# Altium project PCB_Project.PrjPcb (part 1 of 4)
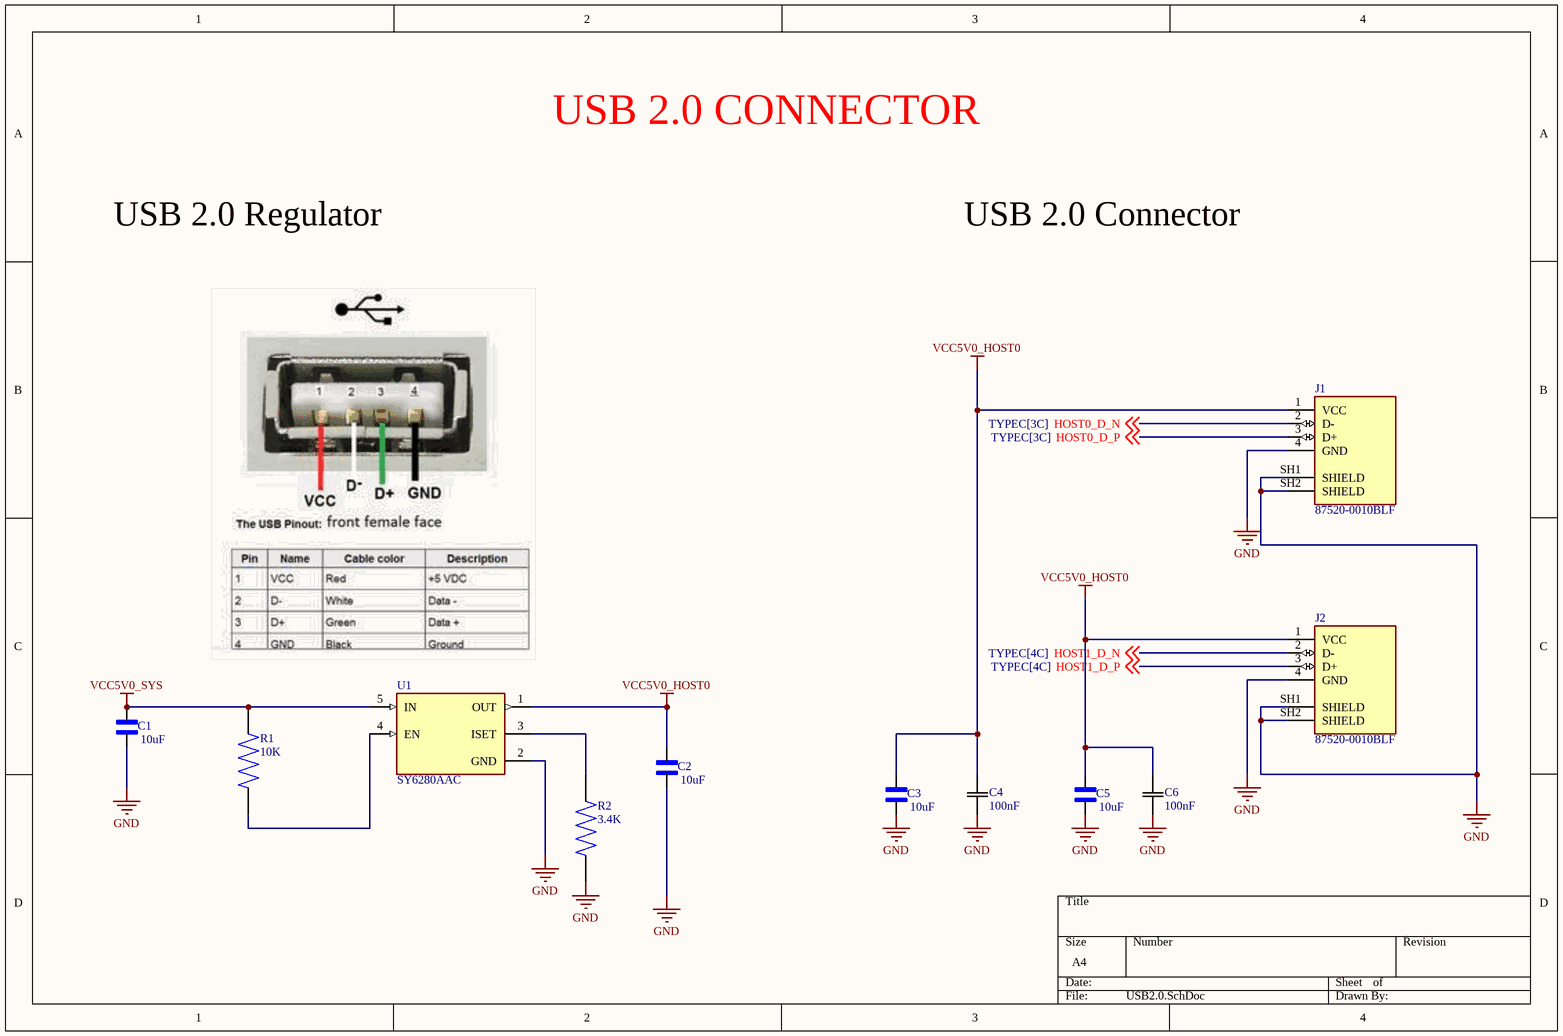
[diagram p0: USB2.0.SchDoc]
26 sheets, 501 parts. Net scope: global (net labels, ports and power ports of the same name join across sheets).
Board file: PCB1.~(76).PcbDoc
Sheets:
  USB2.0.SchDoc
  TYPEC0.SchDoc
  TYPEC.SchDoc
  System PMU for RK3399.SchDoc
  RGMII_SDIO_I2S.SchDoc
  SDMMC EMMC PCIE ADC Blocks.SchDoc
  RK3399 Side of LPDDR4 Controller.SchDoc
  Power Supply Page for RK3399.SchDoc
  HDMI_MIPI-DSI_EDP.SchDoc
  HDMI Connector for RK3399.SchDoc
  PMIC_Block_.SchDoc
  LPDDR4 SDRAM_1.SchDoc
  LPDDR4 SDRAM_2.SchDoc
  EMMC with rk399.SchDoc
  WIFI_MODULE.SchDoc
  SD Card and Debug Uart.SchDoc
  RGMII ETH PHY.SchDoc
  RJ45 Connector and ESD Diodes.SchDoc
  Regulators and Buck Converters.SchDoc
  Power Supply for CPU Blocks.SchDoc
  MIPI CSI 0 and 1 Connectors.SchDoc
  EDP and MIPI DSI Connectors.SchDoc
  CODEC and Headphone Jack.SchDoc
  40 Pin BS, FAN Connector and Test LEDs.SchDoc
  PCIE Connector.SchDoc
  I2C_GPIOs_MIPI-CSI.SchDoc

## Sheet USB2.0.SchDoc
size A4; SheetNumber: 1; SheetTotal: 26

### Parts
C1  10uF  [CAPC1005X70N]
C2  10uF  [CAPC1005X70N]
C3  10uF  [CAPC1005X70N]
C4  100nF  [CAP_1005_TDK]
C5  10uF  [CAPC1005X70N]
C6  100nF  [CAP_1005_TDK]
J1  87520-0010BLF  [AMPHENOL_87520-0010BLF]
J2  87520-0010BLF  [AMPHENOL_87520-0010BLF]
R1  10K  [RES_ERA3ARB103V]
R2  3.4K  [RES_ERJPA2F3401X]
U1  SY6280AAC  [SOT95P285X130-5N]

### Nets
GND: C1.1 C2.1 C3.1 C4.2 C5.1 C6.2 J1.4(GND) J1.SH1(SHIELD) J1.SH2(SHIELD) J2.4(GND) J2.SH1(SHIELD) J2.SH2(SHIELD) R2.1 U1.2(GND)
VCC5V0_HOST0: C2.2 C3.2 C4.1 C5.2 C6.1 J1.1(VCC) J2.1(VCC) U1.1(OUT)
VCC5V0_SYS: C1.2 R1.2 U1.5(IN)
HOST0_D_N: J1.2(D-) ; off-sheet HOST0_D_N
HOST0_D_P: J1.3(D+) ; off-sheet HOST0_D_P
HOST1_D_N: J2.2(D-) ; off-sheet HOST1_D_N
HOST1_D_P: J2.3(D+) ; off-sheet HOST1_D_P
NetR1_1: R1.1 U1.4(EN)
NetR2_2: R2.2 U1.3(ISET)

### Notes on the sheet
- USB 2.0 CONNECTOR
- USB 2.0 Regulator
- USB 2.0 Connector

### Library data of the parts
C1-C3 C5 = CL05A106MQ5NUNC: 10 ÂµF Â±20% 6.3V Ceramic Capacitor X5R 0402 (1005 Metric); MF: Samsung; SnapEDA_Link: https://www.snapeda.com/parts/CL05A106MQ5NUNC/Samsung/view-part/?ref=snap; Package: SMD-2 Samsung; Value: *; MP: CL05A106MQ5NUNC; Check_prices: https://www.snapeda.com/parts/CL05A106MQ5NUNC/Samsung/view-part/?ref=eda
C4 C6 = C1005X7R1H104M050BB: Description; Manufacturer_Name: TDK; Copyright: Copyright (C) 2025 Ultra Librarian. All rights reserved.; Manufacturer_Part_Number: C1005X7R1H104M050BB
J1 J2 = 87520-0010BLF: Conn Data USB TypeA Socket 4Cnts RightAngle ThruHole White 1.57mmPCB | Amphenol FCI (Amphenol CS) 87520-0010BLF; MF: AMPHENOL ICC / FCI; SnapEDA_Link: https://www.snapeda.com/parts/87520-0010BLF/Amphenol/view-part/?ref=snap; Package: None; Value: *; MP: 87520-0010BLF; Check_prices: https://www.snapeda.com/parts/87520-0010BLF/Amphenol/view-part/?ref=eda
R1 = ERA3ARB103V: MP: ERA3ARB103V; Availability: Unavailable; Package: None; Value: *; Price: None
R2 = ERJPA2F3401X: Package: None; Price: None; Value: *; MP: ERJPA2F3401X; Availability: Unavailable
U1 = SY6280AAC: USB Power Distribution SW Single 5.5V 1A 5-Pin SOT-23; MF: Silergy; SnapEDA_Link: https://www.snapeda.com/parts/SY6280AAC/Silergy/view-part/?ref=snap; Package: SOT-23-5 Silergy; Value: *; MP: SY6280AAC; Check_prices: https://www.snapeda.com/parts/SY6280AAC/Silergy/view-part/?ref=eda

## Sheet TYPEC0.SchDoc
size A4; SheetNumber: 2; SheetTotal: 26
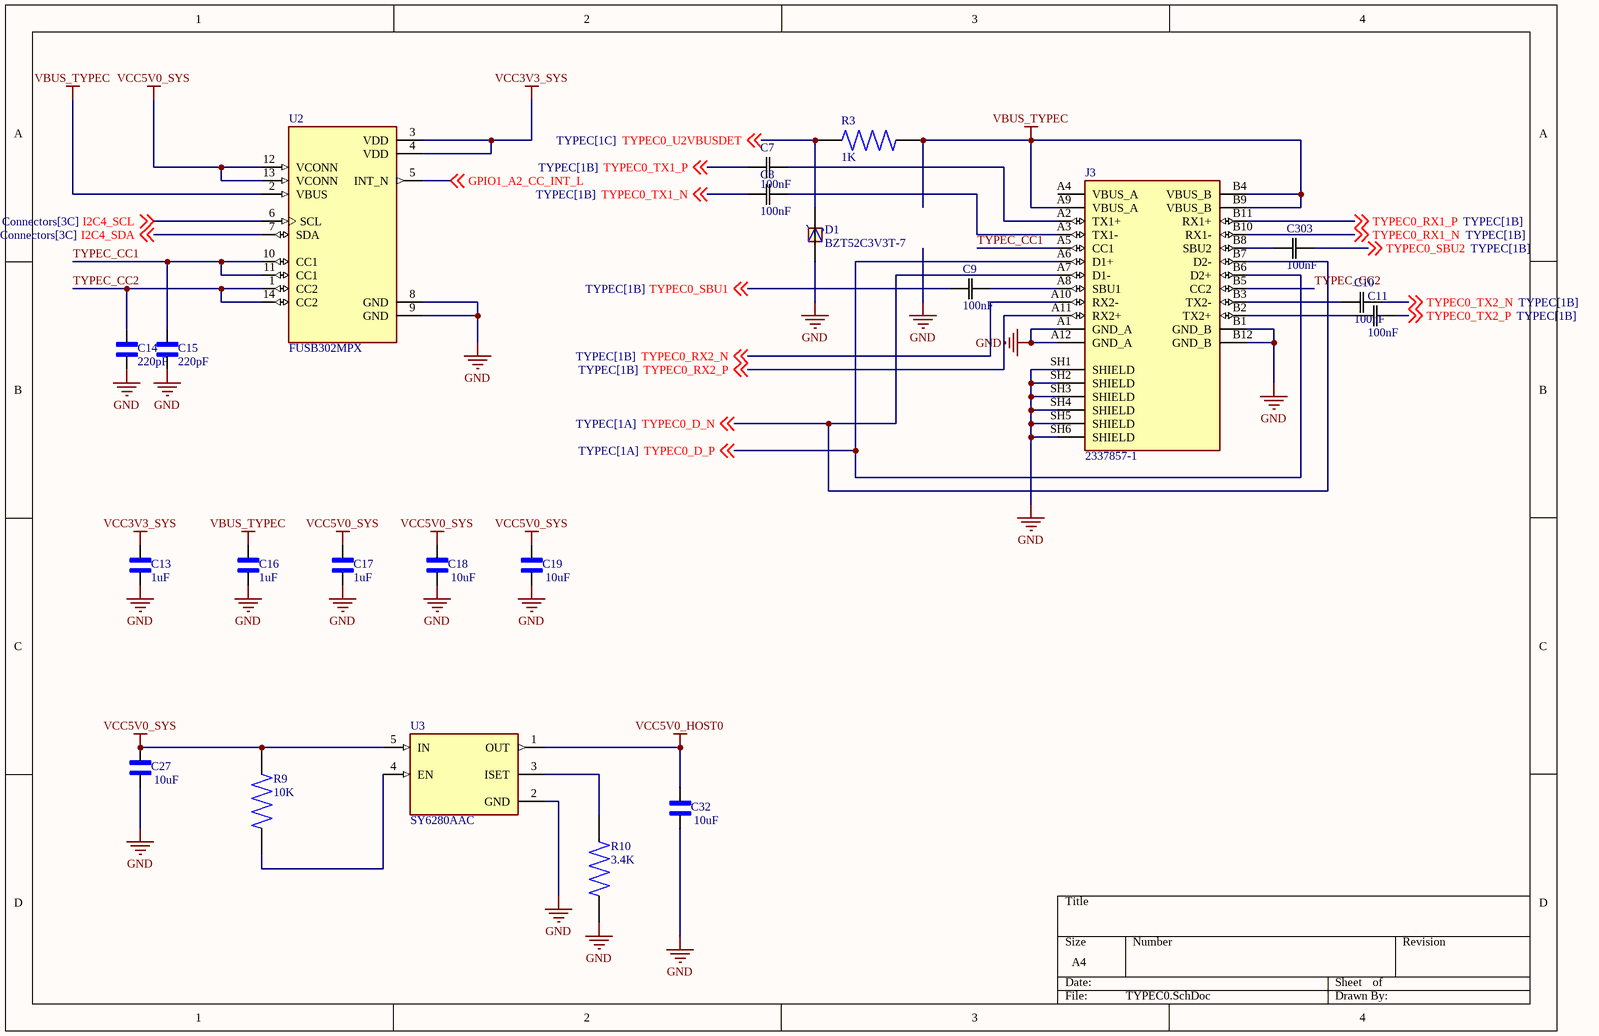
[diagram p1: TYPEC0.SchDoc]

### Parts
C7  100nF  [CAP_1005_TDK]
C8  100nF  [CAP_1005_TDK]
C9  100nF  [CAP_1005_TDK]
C10  100nF  [CAP_1005_TDK]
C11  100nF  [CAP_1005_TDK]
C13  1uF  [CAPC1005X56N]
C14  220pF  [CAPC1608X90]
C15  220pF  [CAPC1608X90]
C16  1uF  [CAPC1005X56N]
C17  1uF  [CAPC1005X56N]
C18  10uF  [CAPC1005X70N]
C19  10uF  [CAPC1005X70N]
C27  10uF  [CAPC1005X70N]
C32  10uF  [CAPC1005X70N]
C303  100nF  [CAP_1005_TDK]
D1  BZT52C3V3T-7  [SODFL1608X65N]
J3  2337857-1  [TE_2337857-1]
R3  1K  [RESC1608X55N]
R9  10K  [RES_ERA3ARB103V]
R10  3.4K  [RES_ERJPA2F3401X]
U2  FUSB302MPX  [QFN50P250X250X80-15N]
U3  SY6280AAC  [SOT95P285X130-5N]

### Nets
GND: C13.1 C14.2 C15.2 C16.1 C17.1 C18.1 C19.1 C27.1 C32.1 D1.A J3.A1(GND_A) J3.A12(GND_A) J3.B1(GND_B) J3.B12(GND_B) J3.SH1(SHIELD) J3.SH2(SHIELD) J3.SH3(SHIELD) J3.SH4(SHIELD) J3.SH5(SHIELD) J3.SH6(SHIELD) R10.1 U2.8(GND) U2.9(GND) U3.2(GND)
VBUS_TYPEC: C16.2 J3.A9(VBUS_A) J3.B4(VBUS_B) J3.B9(VBUS_B) R3.2 U2.2(VBUS)
VCC3V3_SYS: C13.2 U2.3(VDD) U2.4(VDD)
VCC5V0_HOST0: C32.2 U3.1(OUT)
VCC5V0_SYS: C17.2 C18.2 C19.2 C27.2 R9.2 U2.12(VCONN) U2.13(VCONN) U3.5(IN)
GPIO1_A2_CC_INT_L: U2.5(INT_N) ; off-sheet GPIO1_A2_CC_INT_L
I2C4_SCL: U2.6(SCL) ; off-sheet I2C4_SCL
I2C4_SDA: U2.7(SDA) ; off-sheet I2C4_SDA
TYPEC0_D_N: J3.A7(D1-) J3.B7(D2-) ; off-sheet TYPEC0_D_N
TYPEC0_D_P: J3.A6(D1+) J3.B6(D2+) ; off-sheet TYPEC0_D_P
TYPEC0_RX1_N: J3.B10(RX1-) ; off-sheet TYPEC0_RX1_N
TYPEC0_RX1_P: J3.B11(RX1+) ; off-sheet TYPEC0_RX1_P
TYPEC0_RX2_N: J3.A10(RX2-) ; off-sheet TYPEC0_RX2_N
TYPEC0_RX2_P: J3.A11(RX2+) ; off-sheet TYPEC0_RX2_P
TYPEC0_SBU1: C9.2 ; off-sheet TYPEC0_SBU1
TYPEC0_SBU2: C303.1 ; off-sheet TYPEC0_SBU2
TYPEC0_TX1_N: C8.2 ; off-sheet TYPEC0_TX1_N
TYPEC0_TX1_P: C7.2 ; off-sheet TYPEC0_TX1_P
TYPEC0_TX2_N: C10.1 ; off-sheet TYPEC0_TX2_N
TYPEC0_TX2_P: C11.1 ; off-sheet TYPEC0_TX2_P
TYPEC0_U2VBUSDET: D1.C R3.1 ; off-sheet TYPEC0_U2VBUSDET
TYPEC_CC1: C15.1 J3.A5(CC1) U2.10(CC1) U2.11(CC1)
TYPEC_CC2: C14.1 J3.B5(CC2) U2.1(CC2) U2.14(CC2)
NetC7_1: C7.1 J3.A2(TX1+)
NetC8_1: C8.1 J3.A3(TX1-)
NetC9_1: C9.1 J3.A8(SBU1)
NetC10_2: C10.2 J3.B3(TX2-)
NetC11_2: C11.2 J3.B2(TX2+)
NetC303_2: C303.2 J3.B8(SBU2)
NetR9_1: R9.1 U3.4(EN)
NetR10_2: R10.2 U3.3(ISET)

Not connected (* = marked no-connect by the designer): J3 A4(VBUS_A)

### Library data of the parts
C7-C11 C303 = C1005X7R1H104M050BB: Description; Manufacturer_Name: TDK; Copyright: Copyright (C) 2025 Ultra Librarian. All rights reserved.; Manufacturer_Part_Number: C1005X7R1H104M050BB
C13 C16 C17 = 0402ZD105KAT4A: 1 ÂµF Â±10% 10V Ceramic Capacitor X5R 0402 (1005 Metric); MF: AVX; SnapEDA_Link: https://www.snapeda.com/parts/0402ZD105KAT4A/AVX/view-part/?ref=snap; Package: 1005 AVX; Value: *; MP: 0402ZD105KAT4A; Check_prices: https://www.snapeda.com/parts/0402ZD105KAT4A/AVX/view-part/?ref=eda
C14 C15 = CC0603KRX7R7BB221: 220 pF Â±10% 16V Ceramic Capacitor X7R 0603 (1608 Metric); MF: Yageo; SnapEDA_Link: https://www.snapeda.com/parts/CC0603KRX7R7BB221/Yageo/view-part/?ref=snap; Package: 0603 Yageo; Value: *; MP: CC0603KRX7R7BB221; Check_prices: https://www.snapeda.com/parts/CC0603KRX7R7BB221/Yageo/view-part/?ref=eda
C18 C19 C27 C32 = CL05A106MQ5NUNC: as C1 on sheet USB2.0; SnapEDA_Link: https://www.snapeda.com/parts/CL05A106MQ5NUNC/Samsung/view-part/?ref=snap; Package: SMD-2 Samsung; Value: *; MP: CL05A106MQ5NUNC; Check_prices: https://www.snapeda.com/parts/CL05A106MQ5NUNC/Samsung/view-part/?ref=eda
D1 = BZT52C3V3T-7: 3.3V 6% 300mW Zener Diode SOD-523 | Diodes Inc BZT52C3V3T-7; MF: Diodes Inc.; SnapEDA_Link: https://www.snapeda.com/parts/BZT52C3V3T-7/Diodes+Inc./view-part/?ref=snap; Package: SOD-523 Diodes Inc.; Value: *; MP: BZT52C3V3T-7; Check_prices: https://www.snapeda.com/parts/BZT52C3V3T-7/Diodes+Inc./view-part/?ref=eda
J3 = 2337857-1: VERTICAL USB TYPE-C REC; MF: TE Connectivity; SnapEDA_Link: https://www.snapeda.com/parts/2337857-1/TE+Connectivity/view-part/?ref=snap; Package: None; Value: *; MP: 2337857-1; Check_prices: https://www.snapeda.com/parts/2337857-1/TE+Connectivity/view-part/?ref=eda
R3 = CRCW06031K00FKECC: 1 kOhms Â±1% 0.1W, 1/10W Chip Resistor 0603 (1608 Metric) - Thick Film; MF: Vishay; SnapEDA_Link: https://www.snapeda.com/parts/CRCW06031K00FKECC/Vishay/view-part/?ref=snap; Package: 0603-2 Vishay; Value: *; MP: CRCW06031K00FKECC; Check_prices: https://www.snapeda.com/parts/CRCW06031K00FKECC/Vishay/view-part/?ref=eda
R9 = ERA3ARB103V: MP: ERA3ARB103V; Availability: Unavailable; Package: None; Value: *; Price: None
R10 = ERJPA2F3401X: Package: None; Price: None; Value: *; MP: ERJPA2F3401X; Availability: Unavailable
U2 = FUSB302MPX: USB Controller USB 3.1 USB Interface 14-MLP (2.5x2.5); MF: ON Semiconductor; SnapEDA_Link: https://www.snapeda.com/parts/FUSB302MPX/Onsemi/view-part/?ref=snap; Package: WFQFN-14 ON Semiconductor; Value: *; MP: FUSB302MPX; Check_prices: https://www.snapeda.com/parts/FUSB302MPX/Onsemi/view-part/?ref=eda
U3 = SY6280AAC: as U1 on sheet USB2.0; SnapEDA_Link: https://www.snapeda.com/parts/SY6280AAC/Silergy/view-part/?ref=snap; Package: SOT-23-5 Silergy; Value: *; MP: SY6280AAC; Check_prices: https://www.snapeda.com/parts/SY6280AAC/Silergy/view-part/?ref=eda

## Sheet TYPEC.SchDoc
size A4; SheetNumber: 3; SheetTotal: 26
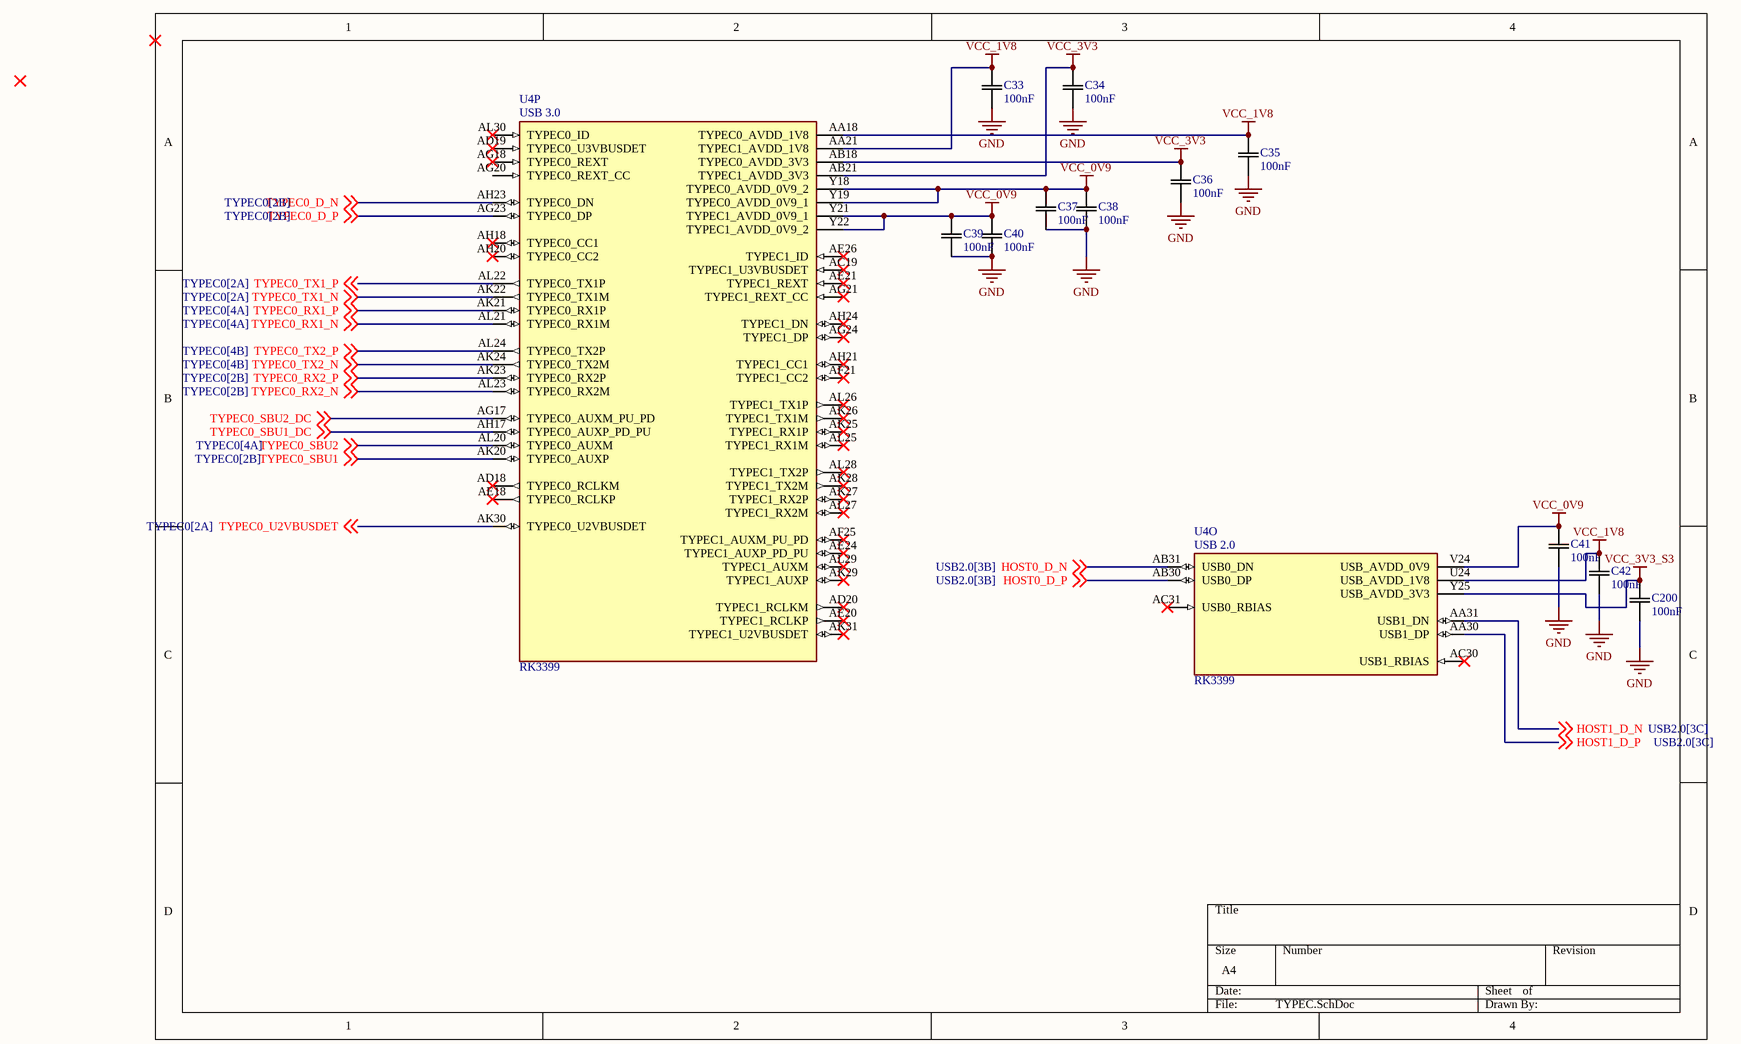
[diagram p2: TYPEC.SchDoc]

### Parts
C33  100nF  [CAP_1005_TDK]
C34  100nF  [CAP_1005_TDK]
C35  100nF  [CAP_1005_TDK]
C36  100nF  [CAP_1005_TDK]
C37  100nF  [CAP_1005_TDK]
C38  100nF  [CAP_1005_TDK]
C39  100nF  [CAP_1005_TDK]
C40  100nF  [CAP_1005_TDK]
C41  100nF  [CAP_1005_TDK]
C42  100nF  [CAP_1005_TDK]
C200  100nF  [CAP_1005_TDK]
U4  RK3399  [BGA828C65P31X31_2100X2100X161N]  (parts O,P of 32)

### Nets
GND: C33.2 C34.2 C35.2 C36.2 C37.2 C38.2 C39.2 C40.2 C41.2 C42.2 C200.2
VCC_0V9: C37.1 C38.1 C39.1 C40.1 C41.1 U4.V24(USB_AVDD_0V9) U4.Y18(TYPEC0_AVDD_0V9_2) U4.Y19(TYPEC0_AVDD_0V9_1) U4.Y21(TYPEC1_AVDD_0V9_1) U4.Y22(TYPEC1_AVDD_0V9_2)
VCC_1V8: C33.1 C35.1 C42.1 U4.AA18(TYPEC0_AVDD_1V8) U4.AA21(TYPEC1_AVDD_1V8) U4.U24(USB_AVDD_1V8)
VCC_3V3: C34.1 C36.1 U4.AB18(TYPEC0_AVDD_3V3) U4.AB21(TYPEC1_AVDD_3V3)
VCC_3V3_S3: C200.1 U4.Y25(USB_AVDD_3V3)
HOST0_D_N: U4.AB31(USB0_DN) ; off-sheet HOST0_D_N
HOST0_D_P: U4.AB30(USB0_DP) ; off-sheet HOST0_D_P
HOST1_D_N: U4.AA31(USB1_DN) ; off-sheet HOST1_D_N
HOST1_D_P: U4.AA30(USB1_DP) ; off-sheet HOST1_D_P
TYPEC0_D_N: U4.AH23(TYPEC0_DN) ; off-sheet TYPEC0_D_N
TYPEC0_D_P: U4.AG23(TYPEC0_DP) ; off-sheet TYPEC0_D_P
TYPEC0_RX1_N: U4.AL21(TYPEC0_RX1M) ; off-sheet TYPEC0_RX1_N
TYPEC0_RX1_P: U4.AK21(TYPEC0_RX1P) ; off-sheet TYPEC0_RX1_P
TYPEC0_RX2_N: U4.AL23(TYPEC0_RX2M) ; off-sheet TYPEC0_RX2_N
TYPEC0_RX2_P: U4.AK23(TYPEC0_RX2P) ; off-sheet TYPEC0_RX2_P
TYPEC0_SBU1: U4.AK20(TYPEC0_AUXP) ; off-sheet TYPEC0_SBU1
TYPEC0_SBU1_DC: U4.AH17(TYPEC0_AUXP_PD_PU) ; off-sheet TYPEC0_SBU1_DC
TYPEC0_SBU2: U4.AL20(TYPEC0_AUXM) ; off-sheet TYPEC0_SBU2
TYPEC0_SBU2_DC: U4.AG17(TYPEC0_AUXM_PU_PD) ; off-sheet TYPEC0_SBU2_DC
TYPEC0_TX1_N: U4.AK22(TYPEC0_TX1M) ; off-sheet TYPEC0_TX1_N
TYPEC0_TX1_P: U4.AL22(TYPEC0_TX1P) ; off-sheet TYPEC0_TX1_P
TYPEC0_TX2_N: U4.AK24(TYPEC0_TX2M) ; off-sheet TYPEC0_TX2_N
TYPEC0_TX2_P: U4.AL24(TYPEC0_TX2P) ; off-sheet TYPEC0_TX2_P
TYPEC0_U2VBUSDET: U4.AK30(TYPEC0_U2VBUSDET) ; off-sheet TYPEC0_U2VBUSDET

Not connected (* = marked no-connect by the designer): U4 AC19(TYPEC1_U3VBUSDET)* AC30(USB1_RBIAS)* AC31(USB0_RBIAS)* AD18(TYPEC0_RCLKM)* AD19(TYPEC0_U3VBUSDET)* AD20(TYPEC1_RCLKM)* AE18(TYPEC0_RCLKP)* AE20(TYPEC1_RCLKP)* AE21(TYPEC1_REXT)* AE24(TYPEC1_AUXP_PD_PU)* AE26(TYPEC1_ID)* AF21(TYPEC1_CC2)* AF25(TYPEC1_AUXM_PU_PD)* AG18(TYPEC0_REXT)* AG20(TYPEC0_REXT_CC) AG21(TYPEC1_REXT_CC)* AG24(TYPEC1_DP)* AH18(TYPEC0_CC1)* AH20(TYPEC0_CC2)* AH21(TYPEC1_CC1)* AH24(TYPEC1_DN)* AK25(TYPEC1_RX1P)* AK26(TYPEC1_TX1M)* AK27(TYPEC1_RX2P)* AK28(TYPEC1_TX2M)* AK29(TYPEC1_AUXP)* AK31(TYPEC1_U2VBUSDET)* AL25(TYPEC1_RX1M)* AL26(TYPEC1_TX1P)* AL27(TYPEC1_RX2M)* AL28(TYPEC1_TX2P)* AL29(TYPEC1_AUXM)* AL30(TYPEC0_ID)*

### Notes on the sheet
- (in symbol RK3399, part O) USB 2.0
- (in symbol RK3399, part P) USB 3.0

### Library data of the parts
C33-C42 C200 = C1005X7R1H104M050BB: Description; Manufacturer_Name: TDK; Copyright: Copyright (C) 2025 Ultra Librarian. All rights reserved.; Manufacturer_Part_Number: C1005X7R1H104M050BB
U4 = RK3399: RK3399 ROCK Pi 4 Model A 2GB - ARMÂ® CortexÂ®-A53, CortexÂ®-A72 MPU Embedded Evaluation Board; MF: Rockchip; SnapEDA_Link: https://www.snapeda.com/parts/RK3399/Fuzhou+Rockchip+Electronics+Co/view-part/?ref=snap; Package: Seeed Technology; MP: RK3399; Check_prices: https://www.snapeda.com/parts/RK3399/Fuzhou+Rockchip+Electronics+Co/view-part/?ref=eda; Price: None; Value: *; Availability: Not in stock

## Sheet System PMU for RK3399.SchDoc
size A4; SheetNumber: 4; SheetTotal: 26
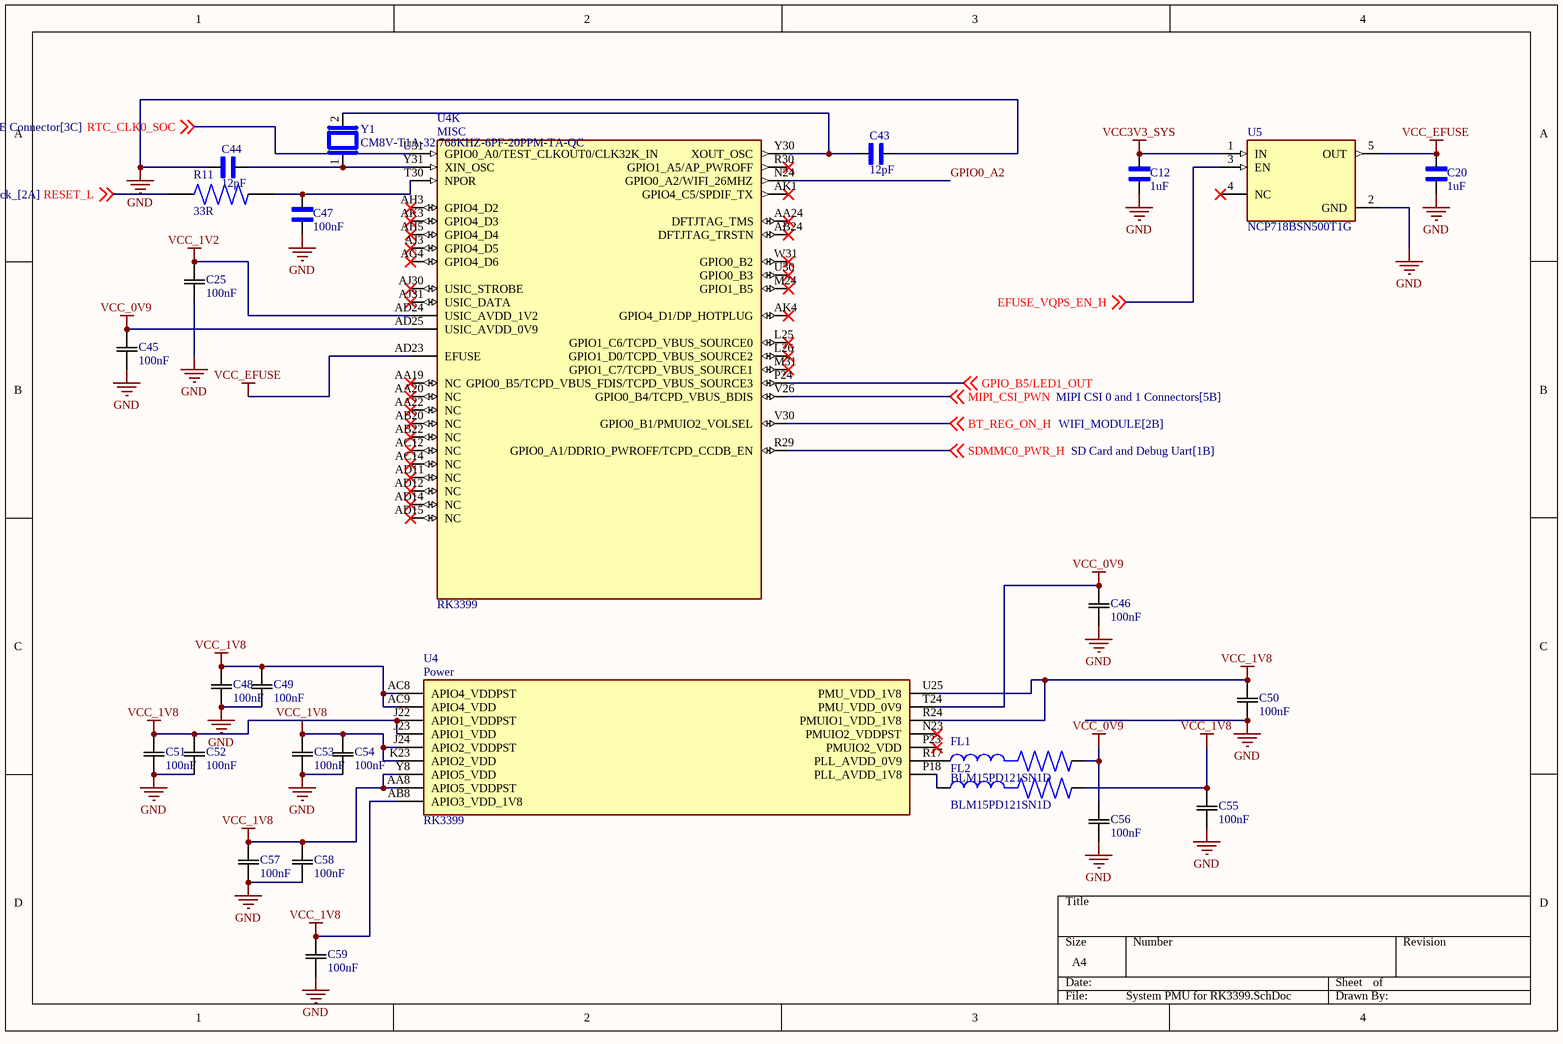
[diagram p3: System PMU for RK3399.SchDoc]

### Parts
C12  1uF  [CAPC1005X56N]
C20  1uF  [CAPC1005X56N]
C25  100nF  [CAP_1005_TDK]
C43  12pF  [CAPC1608X90]
C44  12pF  [CAPC0603X33N]
C45  100nF  [CAP_1005_TDK]
C46  100nF  [CAP_1005_TDK]
C47  100nF  [CAPC2012X90N]
C48  100nF  [CAP_1005_TDK]
C49  100nF  [CAP_1005_TDK]
C50  100nF  [CAP_1005_TDK]
C51  100nF  [CAP_1005_TDK]
C52  100nF  [CAP_1005_TDK]
C53  100nF  [CAP_1005_TDK]
C54  100nF  [CAP_1005_TDK]
C55  100nF  [CAP_1005_TDK]
C56  100nF  [CAP_1005_TDK]
C57  100nF  [CAP_1005_TDK]
C58  100nF  [CAP_1005_TDK]
C59  100nF  [CAP_1005_TDK]
FL1  BLM15PD121SN1D  [BEADC1005X55N]
FL2  BLM15PD121SN1D  [BEADC1005X55N]
R11  33R  [RES_ERA6AHD330V]
U4  RK3399  [BGA828C65P31X31_2100X2100X161N]  (parts K,29 of 32)
U5  NCP718BSN500T1G  [SOT95P280X100-5N]
Y1  CM8V-T1A-32.768KHZ-6PF-20PPM-TA-QC  [XTAL_CM8V-T1A-32.768KHZ-6PF-20PPM-TA-QC]

### Nets
GND: C12.2 C20.2 C25.2 C43.1 C44.1 C45.2 C46.2 C47.2 C48.2 C49.2 C50.2 C51.2 C52.2 C53.2 C54.1 C55.2 C56.2 C57.2 C58.2 C59.2 U5.2(GND)
VCC3V3_SYS: C12.1 U5.1(IN)
VCC_0V9: C45.1 C46.1 C56.1 FL1.2 U4.AD25(USIC_AVDD_0V9) U4.T24(PMU_VDD_0V9)
VCC_1V2: C25.1 U4.AD24(USIC_AVDD_1V2)
VCC_1V8: C48.1 C49.1 C50.1 C51.1 C52.1 C53.1 C54.2 C55.1 C57.1 C58.1 C59.1 FL2.2 U4.AA8(APIO5_VDDPST) U4.AB8(APIO3_VDD_1V8) U4.AC8(APIO4_VDDPST) U4.AC9(APIO4_VDD) U4.J22(APIO1_VDDPST) U4.J23(APIO1_VDD) U4.J24(APIO2_VDDPST) U4.K23(APIO2_VDD) U4.R24(PMUIO1_VDD_1V8) U4.U25(PMU_VDD_1V8) U4.Y8(APIO5_VDD)
VCC_EFUSE: C20.1 U4.AD23(EFUSE) U5.5(OUT)
BT_REG_ON_H: U4.V30(GPIO0_B1/PMUIO2_VOLSEL) ; off-sheet BT_REG_ON_H
EFUSE_VQPS_EN_H: U5.3(EN) ; off-sheet EFUSE_VQPS_EN_H
GPIO0_A2: U4.N24(GPIO0_A2/WIFI_26MHZ)
GPIO_B5/LED1_OUT: U4.P24(GPIO0_B5/TCPD_VBUS_FDIS/TCPD_VBUS_SOURCE3) ; off-sheet GPIO_B5/LED1_OUT
MIPI_CSI_PWN: U4.V26(GPIO0_B4/TCPD_VBUS_BDIS) ; off-sheet MIPI_CSI_PWN
RESET_L: R11.1 ; off-sheet RESET_L
RTC_CLK0_SOC: U4.U31(GPIO0_A0/TEST_CLKOUT0/CLK32K_IN) ; off-sheet RTC_CLK0_SOC
SDMMC0_PWR_H: U4.R29(GPIO0_A1/DDRIO_PWROFF/TCPD_CCDB_EN) ; off-sheet SDMMC0_PWR_H
NetC43_2: C43.2 U4.Y30(XOUT_OSC) Y1.2
NetC44_2: C44.2 U4.Y31(XIN_OSC) Y1.1
NetC47_1: C47.1 R11.2 U4.T30(NPOR)
NetFL1_1: FL1.1 U4.R17(PLL_AVDD_0V9)
NetFL2_1: FL2.1 U4.P18(PLL_AVDD_1V8)

Not connected (* = marked no-connect by the designer): U4 AA19(NC)* AA20(NC)* AA22(NC)* AA24(DFTJTAG_TMS)* AB20(NC)* AB22(NC)* AB24(DFTJTAG_TRSTN)* AC12(NC)* AC14(NC)* AD11(NC)* AD12(NC)* AD14(NC)* AD15(NC)* AG4(GPIO4_D6)* AH3(GPIO4_D2)* AH5(GPIO4_D4)* AJ3(GPIO4_D5)* AJ30(USIC_STROBE)* AJ31(USIC_DATA)* AK1(GPIO4_C5/SPDIF_TX)* AK3(GPIO4_D3)* AK4(GPIO4_D1/DP_HOTPLUG)* L25(GPIO1_C6/TCPD_VBUS_SOURCE0)* L26(GPIO1_D0/TCPD_VBUS_SOURCE2)* M24(GPIO1_B5)* M31(GPIO1_C7/TCPD_VBUS_SOURCE1)* N23(PMUIO2_VDDPST)* P23(PMUIO2_VDD)* R30(GPIO1_A5/AP_PWROFF)* U30(GPIO0_B3)* W31(GPIO0_B2)*; U5 4(NC)*

### Notes on the sheet
- (in symbol RK3399, part K) MISC
- (in symbol RK3399, part 29) Power

### Library data of the parts
C12 C20 = 0402ZD105KAT4A: as C13 on sheet TYPEC0; SnapEDA_Link: https://www.snapeda.com/parts/0402ZD105KAT4A/AVX/view-part/?ref=snap; Package: 1005 AVX; Value: *; MP: 0402ZD105KAT4A; Check_prices: https://www.snapeda.com/parts/0402ZD105KAT4A/AVX/view-part/?ref=eda
C25 C45 C46 C48-C59 = C1005X7R1H104M050BB: Description; Manufacturer_Name: TDK; Copyright: Copyright (C) 2025 Ultra Librarian. All rights reserved.; Manufacturer_Part_Number: C1005X7R1H104M050BB
C43 = 06035J120FBSTR: 12 pF Thin Film Capacitor 50 V 0603 (1608 Metric); MF: AVX; SnapEDA_Link: https://www.snapeda.com/parts/06035J120FBSTR/AVX/view-part/?ref=snap; Package: 0603-2 AVX; Value: *; MP: 06035J120FBSTR; Check_prices: https://www.snapeda.com/parts/06035J120FBSTR/AVX/view-part/?ref=eda
C44 = 02013A120GAT2A: Cap Ceramic 12pF 25V C0G 2% Pad SMD 0201 125Â°C T/R; MF: KYOCERA AVX Components; SnapEDA_Link: https://www.snapeda.com/parts/02013A120GAT2A/Kyocera/view-part/?ref=snap; Package: 0603 AVX; Value: *; MP: 02013A120GAT2A; Check_prices: https://www.snapeda.com/parts/02013A120GAT2A/Kyocera/view-part/?ref=eda
C47 = VJ0805Y104KXXCW1BC: Capacitor: ceramic; MLCC; 100nF; 25V; X7R; Â±10%; SMD; 0805; MF: Vishay Vitramon; SnapEDA_Link: https://www.snapeda.com/parts/VJ0805Y104KXXCW1BC/Vishay/view-part/?ref=snap; Package: 0805-2 VISHAY; Value: *; MP: VJ0805Y104KXXCW1BC; Check_prices: https://www.snapeda.com/parts/VJ0805Y104KXXCW1BC/Vishay/view-part/?ref=eda
FL1 FL2 = BLM15PD121SN1D: 120 Ohms @ 100 MHz 1 Power Line Ferrite Bead 0402 (1005 Metric) 1.3A 90mOhm; MF: Murata; SnapEDA_Link: https://www.snapeda.com/parts/BLM15PD121SN1D/Murata/view-part/?ref=snap; Package: 1005 Taiyo Yuden; Value: *; MP: BLM15PD121SN1D; Check_prices: https://www.snapeda.com/parts/BLM15PD121SN1D/Murata/view-part/?ref=eda
R11 = ERA6AHD330V: Package: None; MP: ERA6AHD330V; Price: None; Value: *; Availability: Unavailable
U4 = RK3399: as U4 on sheet TYPEC; SnapEDA_Link: https://www.snapeda.com/parts/RK3399/Fuzhou+Rockchip+Electronics+Co/view-part/?ref=snap; Package: Seeed Technology; MP: RK3399; Check_prices: https://www.snapeda.com/parts/RK3399/Fuzhou+Rockchip+Electronics+Co/view-part/?ref=eda; Price: None; Value: *; Availability: Not in stock
U5 = NCP718BSN500T1G: Linear Voltage Regulator IC Positive Fixed 1 Output 300mA TSOT-23-5; MF: ON Semiconductor; SnapEDA_Link: https://www.snapeda.com/parts/NCP718BSN500T1G/Onsemi/view-part/?ref=snap; Package: TSOT-23-5 ON Semiconductor; Value: *; MP: NCP718BSN500T1G; Check_prices: https://www.snapeda.com/parts/NCP718BSN500T1G/Onsemi/view-part/?ref=eda
Y1 = CM8V-T1A-32.768KHZ-6PF-20PPM-TA-QC: Tuning Fork Crystal 32.768kHz in SMD 1.2 x 2.0mm package; MF: Micro Crystal; SnapEDA_Link: https://www.snapeda.com/parts/CM8V-T1A-32.768kHz-6pF-20PPM-TA-QC/Micro+Crystal/view-part/?ref=snap; Package: SMD-2 Micro Crystal; Value: *; MP: CM8V-T1A-32.768kHz-6pF-20PPM-TA-QC; Check_prices: https://www.snapeda.com/parts/CM8V-T1A-32.768kHz-6pF-20PPM-TA-QC/Micro+Crystal/view-part/?ref=eda

## Sheet RGMII_SDIO_I2S.SchDoc
size 420 x 297 mm; SheetNumber: 5; SheetTotal: 26
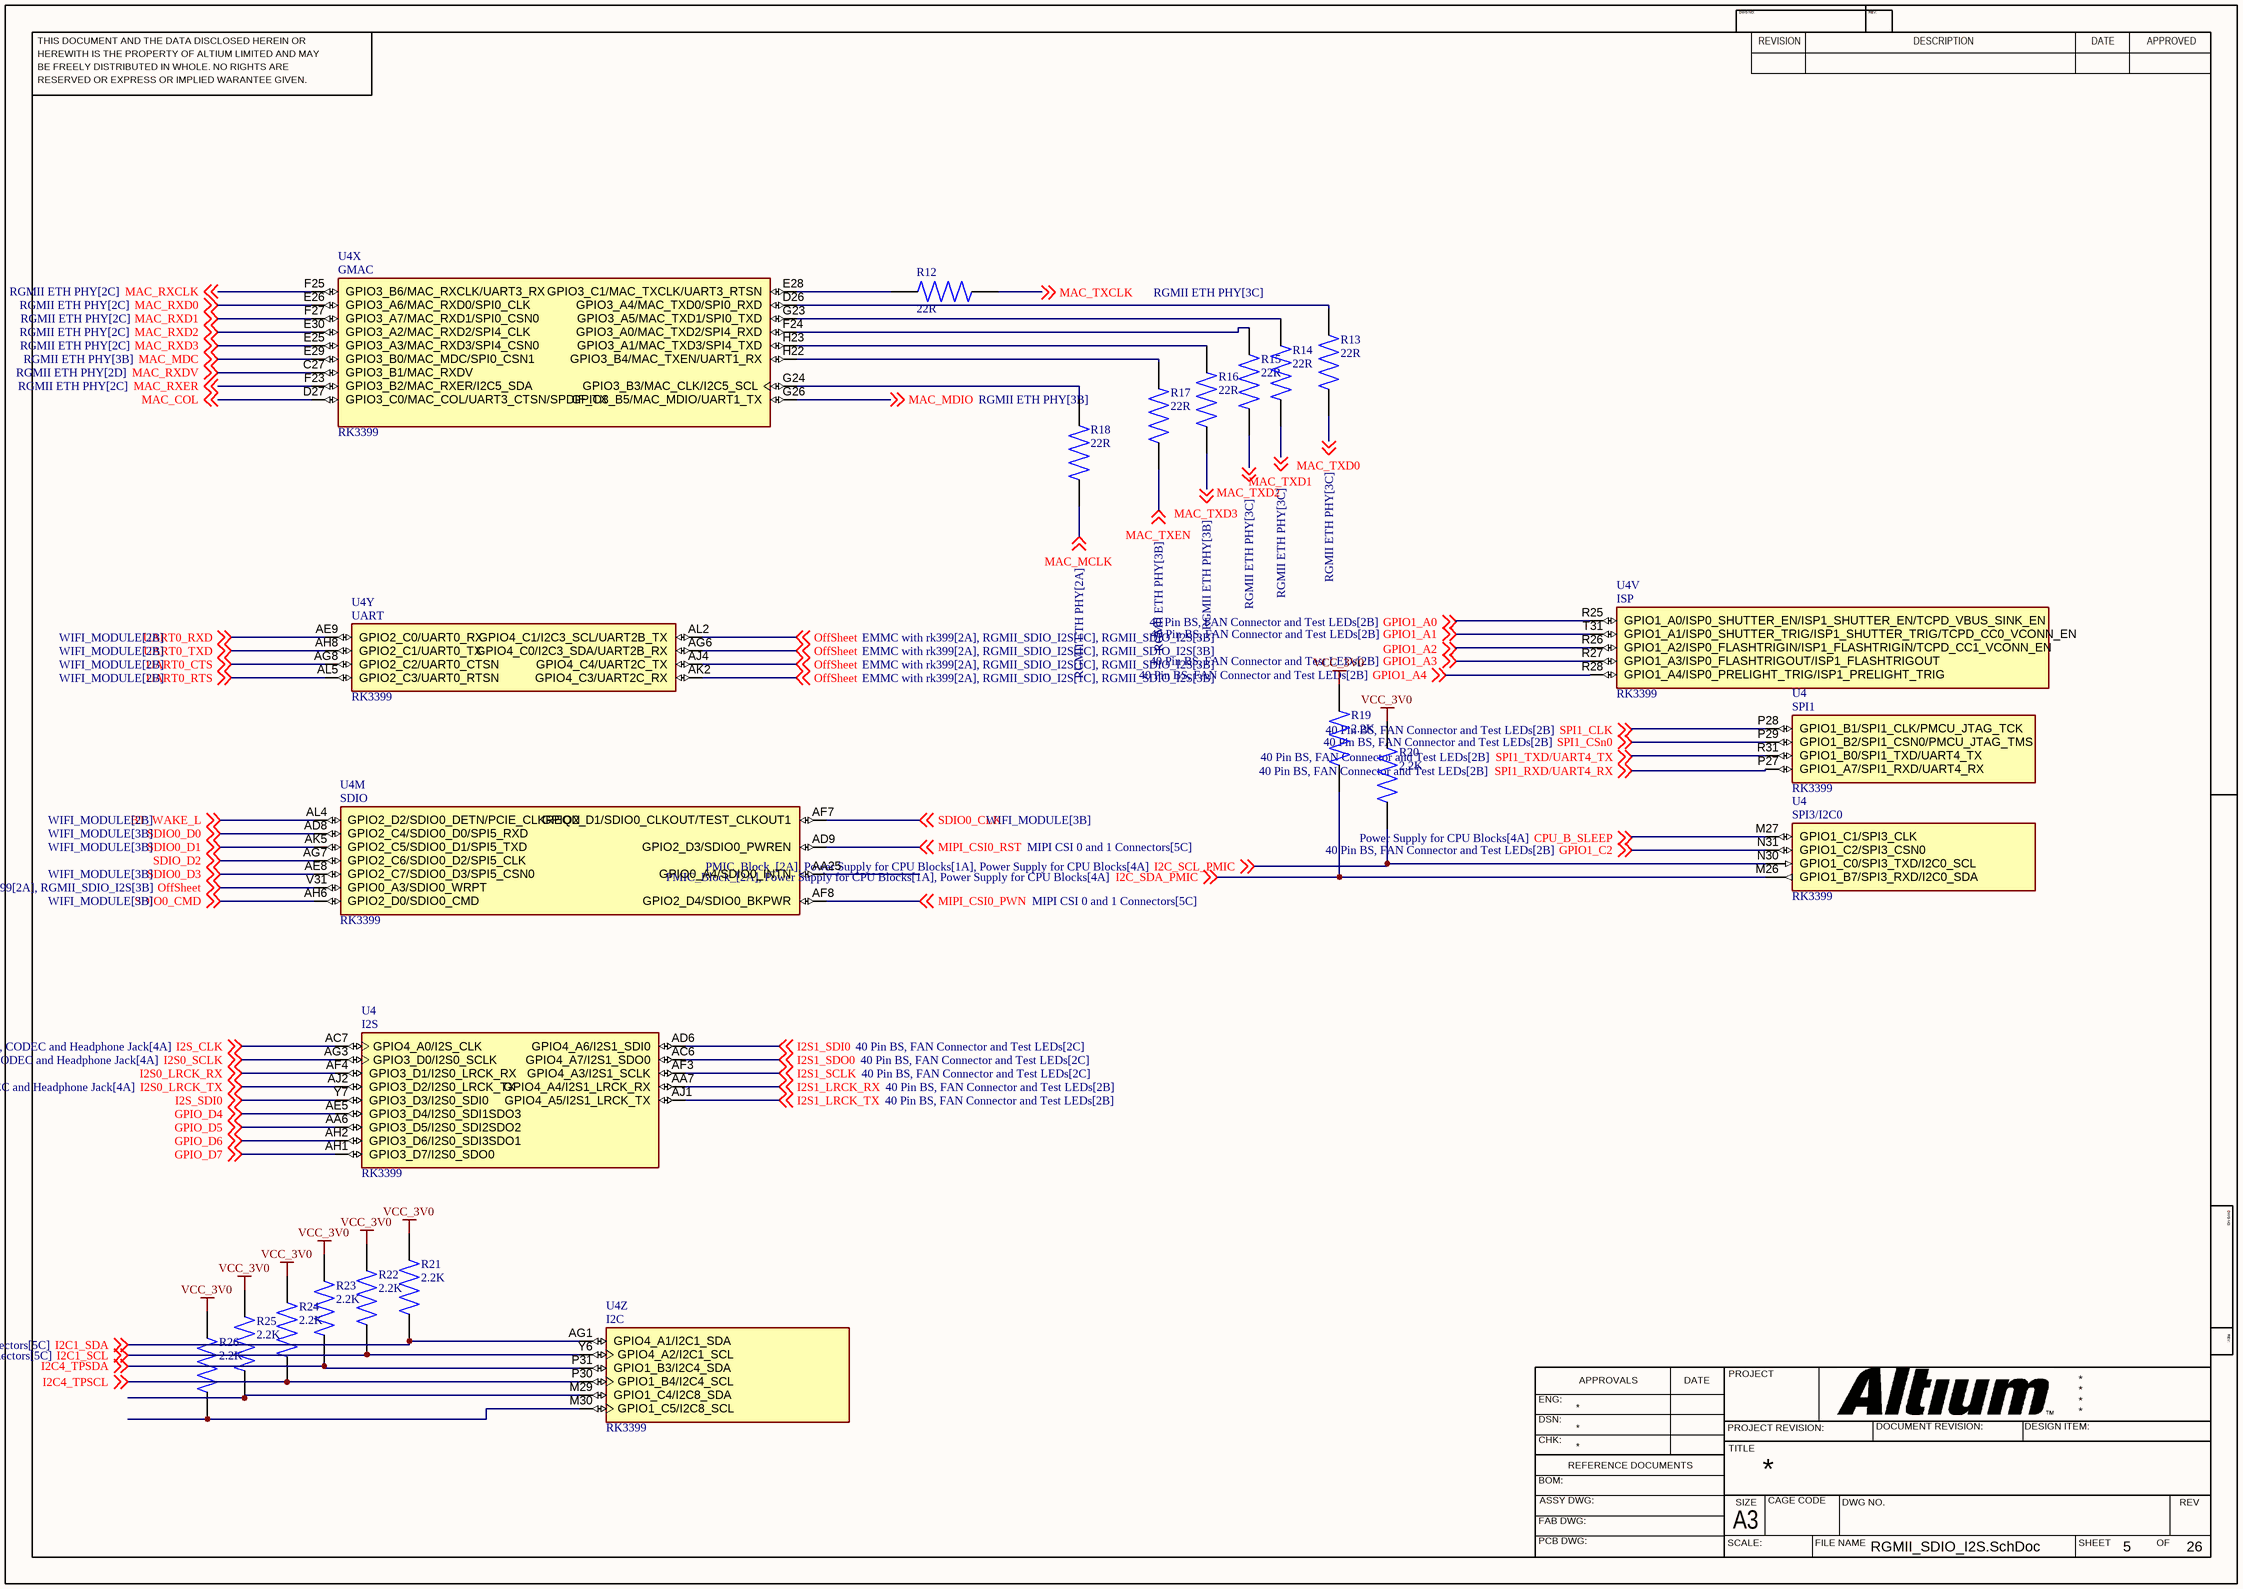
[diagram p4: RGMII_SDIO_I2S.SchDoc]

### Parts
R12  22R  [RES_ERA6AHD330V]
R13  22R  [RES_ERA6AHD330V]
R14  22R  [RES_ERA6AHD330V]
R15  22R  [RES_ERA6AHD330V]
R16  22R  [RES_ERA6AHD330V]
R17  22R  [RES_ERA6AHD330V]
R18  22R  [RES_ERA6AHD330V]
R19  2.2K  [RES_ERA8APB222V]
R20  2.2K  [RES_ERA8APB222V]
R21  2.2K  [RES_ERA8APB222V]
R22  2.2K  [RES_ERA8APB222V]
R23  2.2K  [RES_ERA8APB222V]
R24  2.2K  [RES_ERA8APB222V]
R25  2.2K  [RES_ERA8APB222V]
R26  2.2K  [RES_ERA8APB222V]
U4  RK3399  [BGA828C65P31X31_2100X2100X161N]  (parts M,V,X,Y,Z,30,31,32 of 32)

### Nets
VCC_3V0: R19.2 R20.2 R21.2 R22.2 R23.2 R24.2 R25.2 R26.2
BT_WAKE_L: U4.AL4(GPIO2_D2/SDIO0_DETN/PCIE_CLKREQN) ; off-sheet BT_WAKE_L
CPU_B_SLEEP: U4.M27(GPIO1_C1/SPI3_CLK) ; off-sheet CPU_B_SLEEP
GPIO1_A0: U4.R25(GPIO1_A0/ISP0_SHUTTER_EN/ISP1_SHUTTER_EN/TCPD_VBUS_SINK_EN) ; off-sheet GPIO1_A0
GPIO1_A1: U4.T31(GPIO1_A1/ISP0_SHUTTER_TRIG/ISP1_SHUTTER_TRIG/TCPD_CC0_VCONN_EN) ; off-sheet GPIO1_A1
GPIO1_A2: U4.R26(GPIO1_A2/ISP0_FLASHTRIGIN/ISP1_FLASHTRIGIN/TCPD_CC1_VCONN_EN) ; off-sheet GPIO1_A2
GPIO1_A3: U4.R27(GPIO1_A3/ISP0_FLASHTRIGOUT/ISP1_FLASHTRIGOUT) ; off-sheet GPIO1_A3
GPIO1_A4: U4.R28(GPIO1_A4/ISP0_PRELIGHT_TRIG/ISP1_PRELIGHT_TRIG) ; off-sheet GPIO1_A4
GPIO1_C2: U4.N31(GPIO1_C2/SPI3_CSN0) ; off-sheet GPIO1_C2
GPIO_D4: U4.AE5(GPIO3_D4/I2S0_SDI1SDO3) ; off-sheet GPIO_D4
GPIO_D5: U4.AA6(GPIO3_D5/I2S0_SDI2SDO2) ; off-sheet GPIO_D5
GPIO_D6: U4.AH2(GPIO3_D6/I2S0_SDI3SDO1) ; off-sheet GPIO_D6
GPIO_D7: U4.AH1(GPIO3_D7/I2S0_SDO0) ; off-sheet GPIO_D7
I2C1_SCL: R22.1 U4.Y6(GPIO4_A2/I2C1_SCL) ; off-sheet I2C1_SCL
I2C1_SDA: R21.1 U4.AG1(GPIO4_A1/I2C1_SDA) ; off-sheet I2C1_SDA
I2C4_TPSCL: R24.1 U4.P30(GPIO1_B4/I2C4_SCL) ; off-sheet I2C4_TPSCL
I2C4_TPSDA: R23.1 U4.P31(GPIO1_B3/I2C4_SDA) ; off-sheet I2C4_TPSDA
I2C_SCL_PMIC: R20.1 U4.N30(GPIO1_C0/SPI3_TXD/I2C0_SCL) ; off-sheet I2C_SCL_PMIC
I2C_SDA_PMIC: R19.1 U4.M26(GPIO1_B7/SPI3_RXD/I2C0_SDA) ; off-sheet I2C_SDA_PMIC
I2S0_LRCK_RX: U4.AF4(GPIO3_D1/I2S0_LRCK_RX) ; off-sheet I2S0_LRCK_RX
I2S0_LRCK_TX: U4.AJ2(GPIO3_D2/I2S0_LRCK_TX) ; off-sheet I2S0_LRCK_TX
I2S0_SCLK: U4.AG3(GPIO3_D0/I2S0_SCLK) ; off-sheet I2S0_SCLK
I2S1_LRCK_RX: U4.AA7(GPIO4_A4/I2S1_LRCK_RX) ; off-sheet I2S1_LRCK_RX
I2S1_LRCK_TX: U4.AJ1(GPIO4_A5/I2S1_LRCK_TX) ; off-sheet I2S1_LRCK_TX
I2S1_SCLK: U4.AF3(GPIO4_A3/I2S1_SCLK) ; off-sheet I2S1_SCLK
I2S1_SDI0: U4.AD6(GPIO4_A6/I2S1_SDI0) ; off-sheet I2S1_SDI0
I2S1_SDO0: U4.AC6(GPIO4_A7/I2S1_SDO0) ; off-sheet I2S1_SDO0
I2S_CLK: U4.AC7(GPIO4_A0/I2S_CLK) ; off-sheet I2S_CLK
I2S_SDI0: U4.Y7(GPIO3_D3/I2S0_SDI0) ; off-sheet I2S_SDI0
MAC_COL: U4.D27(GPIO3_C0/MAC_COL/UART3_CTSN/SPDIF_TX) ; off-sheet MAC_COL
MAC_MCLK: R18.1 ; off-sheet MAC_MCLK
MAC_MDC: U4.E29(GPIO3_B0/MAC_MDC/SPI0_CSN1) ; off-sheet MAC_MDC
MAC_MDIO: U4.G26(GPIO3_B5/MAC_MDIO/UART1_TX) ; off-sheet MAC_MDIO
MAC_RXCLK: U4.F25(GPIO3_B6/MAC_RXCLK/UART3_RX) ; off-sheet MAC_RXCLK
MAC_RXD0: U4.E26(GPIO3_A6/MAC_RXD0/SPI0_CLK) ; off-sheet MAC_RXD0
MAC_RXD1: U4.F27(GPIO3_A7/MAC_RXD1/SPI0_CSN0) ; off-sheet MAC_RXD1
MAC_RXD2: U4.E30(GPIO3_A2/MAC_RXD2/SPI4_CLK) ; off-sheet MAC_RXD2
MAC_RXD3: U4.E25(GPIO3_A3/MAC_RXD3/SPI4_CSN0) ; off-sheet MAC_RXD3
MAC_RXDV: U4.C27(GPIO3_B1/MAC_RXDV) ; off-sheet MAC_RXDV
MAC_RXER: U4.F23(GPIO3_B2/MAC_RXER/I2C5_SDA) ; off-sheet MAC_RXER
MAC_TXCLK: R12.1 ; off-sheet MAC_TXCLK
MAC_TXD0: R13.1 ; off-sheet MAC_TXD0
MAC_TXD1: R14.1 ; off-sheet MAC_TXD1
MAC_TXD2: R15.1 ; off-sheet MAC_TXD2
MAC_TXD3: R16.1 ; off-sheet MAC_TXD3
MAC_TXEN: R17.1 ; off-sheet MAC_TXEN
MIPI_CSI0_PWN: U4.AF8(GPIO2_D4/SDIO0_BKPWR) ; off-sheet MIPI_CSI0_PWN
MIPI_CSI0_RST: U4.AD9(GPIO2_D3/SDIO0_PWREN) ; off-sheet MIPI_CSI0_RST
OffSheet: U4.AG6(GPIO4_C0/I2C3_SDA/UART2B_RX) U4.AJ4(GPIO4_C4/UART2C_TX) U4.AK2(GPIO4_C3/UART2C_RX) U4.AL2(GPIO4_C1/I2C3_SCL/UART2B_TX) U4.V31(GPIO0_A3/SDIO0_WRPT) ; off-sheet OffSheet
SDIO0_CLK: U4.AF7(GPIO2_D1/SDIO0_CLKOUT/TEST_CLKOUT1) ; off-sheet SDIO0_CLK
SDIO0_CMD: U4.AH6(GPIO2_D0/SDIO0_CMD) ; off-sheet SDIO0_CMD
SDIO0_D0: U4.AD8(GPIO2_C4/SDIO0_D0/SPI5_RXD) ; off-sheet SDIO0_D0
SDIO0_D1: U4.AK5(GPIO2_C5/SDIO0_D1/SPI5_TXD) ; off-sheet SDIO0_D1
SDIO0_D3: U4.AE8(GPIO2_C7/SDIO0_D3/SPI5_CSN0) ; off-sheet SDIO0_D3
SDIO_D2: U4.AG7(GPIO2_C6/SDIO0_D2/SPI5_CLK) ; off-sheet SDIO_D2
SPI1_CLK: U4.P28(GPIO1_B1/SPI1_CLK/PMCU_JTAG_TCK) ; off-sheet SPI1_CLK
SPI1_CSn0: U4.P29(GPIO1_B2/SPI1_CSN0/PMCU_JTAG_TMS) ; off-sheet SPI1_CSn0
SPI1_RXD/UART4_RX: U4.P27(GPIO1_A7/SPI1_RXD/UART4_RX) ; off-sheet SPI1_RXD/UART4_RX
SPI1_TXD/UART4_TX: U4.R31(GPIO1_B0/SPI1_TXD/UART4_TX) ; off-sheet SPI1_TXD/UART4_TX
UART0_CTS: U4.AG8(GPIO2_C2/UART0_CTSN) ; off-sheet UART0_CTS
UART0_RTS: U4.AL5(GPIO2_C3/UART0_RTSN) ; off-sheet UART0_RTS
UART0_RXD: U4.AE9(GPIO2_C0/UART0_RX) ; off-sheet UART0_RXD
UART0_TXD: U4.AH8(GPIO2_C1/UART0_TX) ; off-sheet UART0_TXD
NetR12_2: R12.2 U4.E28(GPIO3_C1/MAC_TXCLK/UART3_RTSN)
NetR13_2: R13.2 U4.D26(GPIO3_A4/MAC_TXD0/SPI0_RXD)
NetR14_2: R14.2 U4.G23(GPIO3_A5/MAC_TXD1/SPI0_TXD)
NetR15_2: R15.2 U4.F24(GPIO3_A0/MAC_TXD2/SPI4_RXD)
NetR16_2: R16.2 U4.H23(GPIO3_A1/MAC_TXD3/SPI4_TXD)
NetR17_2: R17.2 U4.H22(GPIO3_B4/MAC_TXEN/UART1_RX)
NetR18_2: R18.2 U4.G24(GPIO3_B3/MAC_CLK/I2C5_SCL)
NetR25_1: R25.1 U4.M29(GPIO1_C4/I2C8_SDA)
NetR26_1: R26.1 U4.M30(GPIO1_C5/I2C8_SCL)

Not connected (* = marked no-connect by the designer): U4 AA25(GPIO0_A4/SDIO0_INTN)

### Notes on the sheet
- THIS DOCUMENT AND THE DATA DISCLOSED HEREIN OR
- HEREWITH IS THE PROPERTY OF ALTIUM LIMITED AND MAY
- DWG NO:
- REVISION
- REV:
- DESCRIPTION
- DATE
- APPROVED
- BE FREELY DISTRIBUTED IN WHOLE. NO RIGHTS ARE
- RESERVED OR EXPRESS OR IMPLIED WARANTEE GIVEN.
- ENG:
- APPROVALS
- PROJECT
- DSN:
- CHK:
- REFERENCE DOCUMENTS
- PROJECT REVISION:
- TITLE
- DOCUMENT REVISION:
- DESIGN ITEM:
- BOM:
- FAB DWG:
- PCB DWG:
- ASSY DWG:
- SCALE:
- A3
- SIZE
- CAGE CODE
- FILE NAME
- DWG NO.
- SHEET
- OF
- REV
- (in symbol RK3399, part M) SDIO
- (in symbol RK3399, part V) ISP
- (in symbol RK3399, part X) GMAC
- (in symbol RK3399, part Y) UART
- (in symbol RK3399, part Z) I2C
- (in symbol RK3399, part 30) SPI1
- (in symbol RK3399, part 31) SPI3/I2C0
- (in symbol RK3399, part 32) I2S

### Library data of the parts
R12-R18 = ERA6AHD330V: Package: None; MP: ERA6AHD330V; Price: None; Value: *; Availability: Unavailable
R19-R26 = ERA8APB222V: Availability: Unavailable; Price: None; Package: None; MP: ERA8APB222V; Value: *
U4 = RK3399: as U4 on sheet TYPEC; SnapEDA_Link: https://www.snapeda.com/parts/RK3399/Fuzhou+Rockchip+Electronics+Co/view-part/?ref=snap; Package: Seeed Technology; MP: RK3399; Check_prices: https://www.snapeda.com/parts/RK3399/Fuzhou+Rockchip+Electronics+Co/view-part/?ref=eda; Price: None; Value: *; Availability: Not in stock

## Sheet SDMMC EMMC PCIE ADC Blocks.SchDoc
size 420 x 297 mm; SheetNumber: 6; SheetTotal: 26
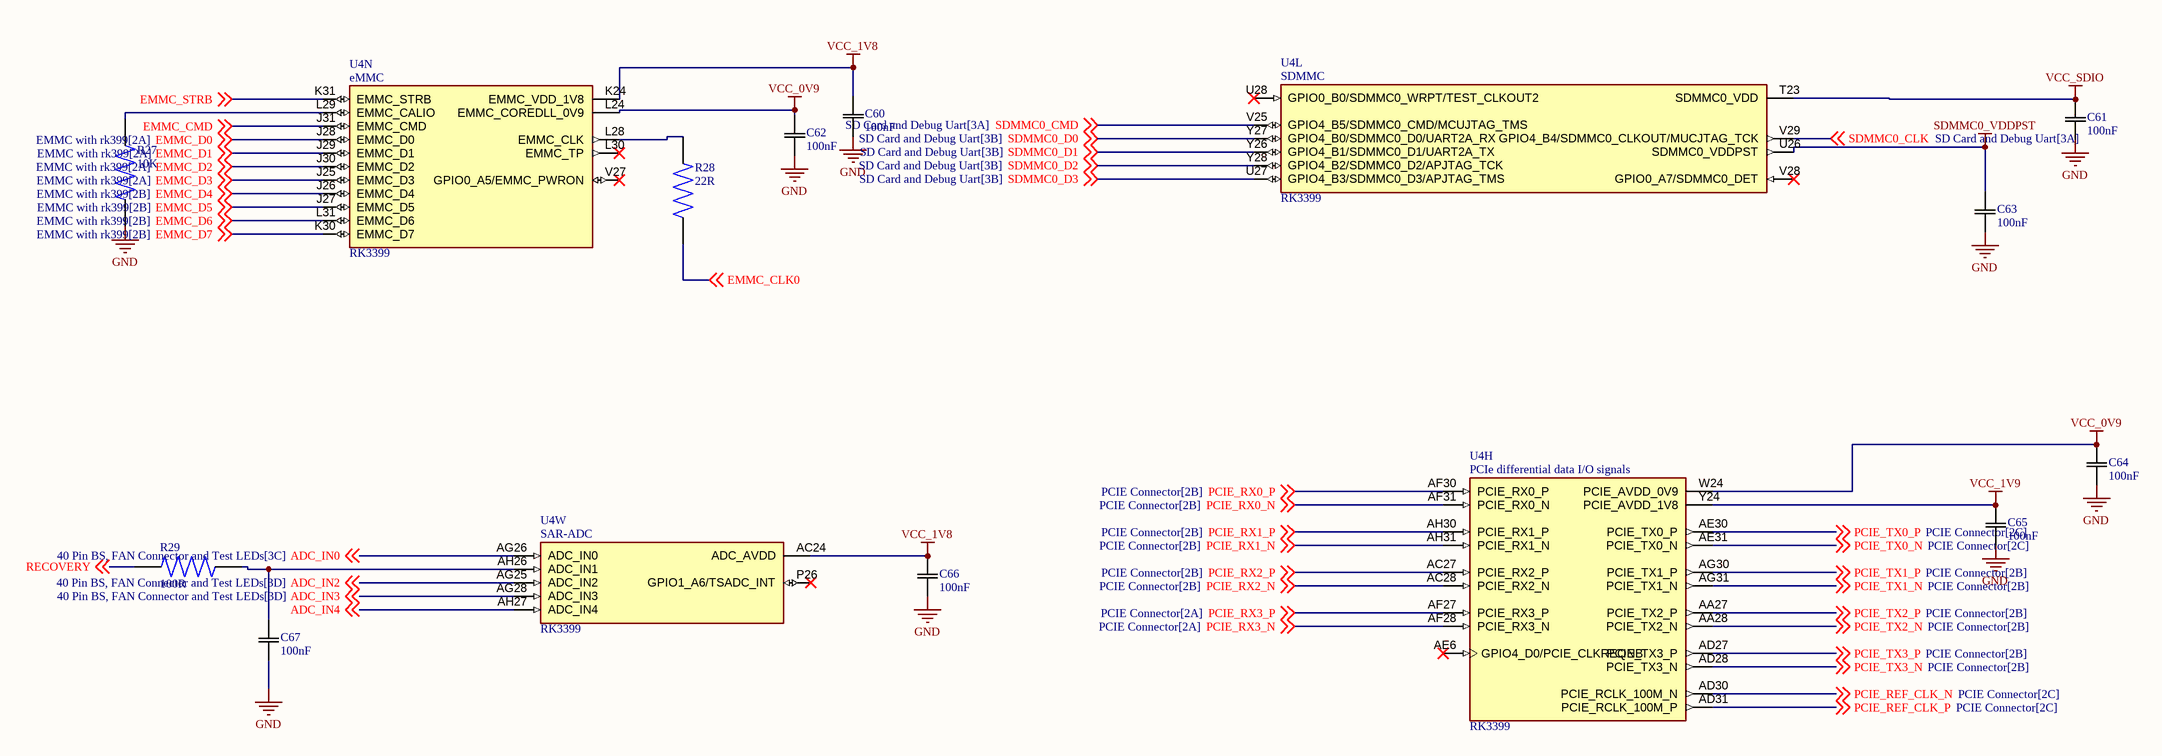
[diagram p5: SDMMC EMMC PCIE ADC Blocks.SchDoc]

### Parts
C60  100nF  [CAP_1005_TDK]
C61  100nF  [CAP_1005_TDK]
C62  100nF  [CAP_1005_TDK]
C63  100nF  [CAP_1005_TDK]
C64  100nF  [CAP_1005_TDK]
C65  100nF  [CAP_1005_TDK]
C66  100nF  [CAP_1005_TDK]
C67  100nF  [CAP_1005_TDK]
R27  10K  [RESC1608X55N]
R28  22R  [RES_ERJXGNJ220Y]
R29  100R  [RES_ERA6AHD330V]
U4  RK3399  [BGA828C65P31X31_2100X2100X161N]  (parts H,L,N,W of 32)

### Nets
GND: C60.2 C61.2 C62.2 C63.2 C64.2 C65.2 C66.2 C67.2 R27.1
SDMMC0_VDDPST: C63.1 U4.U26(SDMMC0_VDDPST)
VCC_0V9: C62.1 C64.1 U4.L24(EMMC_COREDLL_0V9) U4.W24(PCIE_AVDD_0V9)
VCC_1V8: C60.1 C66.1 U4.AC24(ADC_AVDD) U4.K24(EMMC_VDD_1V8)
VCC_1V9: C65.1 U4.Y24(PCIE_AVDD_1V8)
VCC_SDIO: C61.1 U4.T23(SDMMC0_VDD)
ADC_IN0: U4.AG26(ADC_IN0) ; off-sheet ADC_IN0
ADC_IN2: U4.AG25(ADC_IN2) ; off-sheet ADC_IN2
ADC_IN3: U4.AG28(ADC_IN3) ; off-sheet ADC_IN3
ADC_IN4: U4.AH27(ADC_IN4) ; off-sheet ADC_IN4
EMMC_CLK0: R28.1 ; off-sheet EMMC_CLK0
EMMC_CMD: U4.J31(EMMC_CMD) ; off-sheet EMMC_CMD
EMMC_D0: U4.J28(EMMC_D0) ; off-sheet EMMC_D0
EMMC_D1: U4.J29(EMMC_D1) ; off-sheet EMMC_D1
EMMC_D2: U4.J30(EMMC_D2) ; off-sheet EMMC_D2
EMMC_D3: U4.J25(EMMC_D3) ; off-sheet EMMC_D3
EMMC_D4: U4.J26(EMMC_D4) ; off-sheet EMMC_D4
EMMC_D5: U4.J27(EMMC_D5) ; off-sheet EMMC_D5
EMMC_D6: U4.L31(EMMC_D6) ; off-sheet EMMC_D6
EMMC_D7: U4.K30(EMMC_D7) ; off-sheet EMMC_D7
EMMC_STRB: U4.K31(EMMC_STRB) ; off-sheet EMMC_STRB
PCIE_REF_CLK_N: U4.AD30(PCIE_RCLK_100M_N) ; off-sheet PCIE_REF_CLK_N
PCIE_REF_CLK_P: U4.AD31(PCIE_RCLK_100M_P) ; off-sheet PCIE_REF_CLK_P
PCIE_RX0_N: U4.AF31(PCIE_RX0_N) ; off-sheet PCIE_RX0_N
PCIE_RX0_P: U4.AF30(PCIE_RX0_P) ; off-sheet PCIE_RX0_P
PCIE_RX1_N: U4.AH31(PCIE_RX1_N) ; off-sheet PCIE_RX1_N
PCIE_RX1_P: U4.AH30(PCIE_RX1_P) ; off-sheet PCIE_RX1_P
PCIE_RX2_N: U4.AC28(PCIE_RX2_N) ; off-sheet PCIE_RX2_N
PCIE_RX2_P: U4.AC27(PCIE_RX2_P) ; off-sheet PCIE_RX2_P
PCIE_RX3_N: U4.AF28(PCIE_RX3_N) ; off-sheet PCIE_RX3_N
PCIE_RX3_P: U4.AF27(PCIE_RX3_P) ; off-sheet PCIE_RX3_P
PCIE_TX0_N: U4.AE31(PCIE_TX0_N) ; off-sheet PCIE_TX0_N
PCIE_TX0_P: U4.AE30(PCIE_TX0_P) ; off-sheet PCIE_TX0_P
PCIE_TX1_N: U4.AG31(PCIE_TX1_N) ; off-sheet PCIE_TX1_N
PCIE_TX1_P: U4.AG30(PCIE_TX1_P) ; off-sheet PCIE_TX1_P
PCIE_TX2_N: U4.AA28(PCIE_TX2_N) ; off-sheet PCIE_TX2_N
PCIE_TX2_P: U4.AA27(PCIE_TX2_P) ; off-sheet PCIE_TX2_P
PCIE_TX3_N: U4.AD28(PCIE_TX3_N) ; off-sheet PCIE_TX3_N
PCIE_TX3_P: U4.AD27(PCIE_TX3_P) ; off-sheet PCIE_TX3_P
RECOVERY: R29.1 ; off-sheet RECOVERY
SDMMC0_CLK: U4.V29(GPIO4_B4/SDMMC0_CLKOUT/MUCJTAG_TCK) ; off-sheet SDMMC0_CLK
SDMMC0_CMD: U4.V25(GPIO4_B5/SDMMC0_CMD/MCUJTAG_TMS) ; off-sheet SDMMC0_CMD
SDMMC0_D0: U4.Y27(GPIO4_B0/SDMMC0_D0/UART2A_RX) ; off-sheet SDMMC0_D0
SDMMC0_D1: U4.Y26(GPIO4_B1/SDMMC0_D1/UART2A_TX) ; off-sheet SDMMC0_D1
SDMMC0_D2: U4.Y28(GPIO4_B2/SDMMC0_D2/APJTAG_TCK) ; off-sheet SDMMC0_D2
SDMMC0_D3: U4.U27(GPIO4_B3/SDMMC0_D3/APJTAG_TMS) ; off-sheet SDMMC0_D3
NetC67_1: C67.1 R29.2 U4.AH26(ADC_IN1)
NetR27_2: R27.2 U4.L29(EMMC_CALIO)
NetR28_2: R28.2 U4.L28(EMMC_CLK)

Not connected (* = marked no-connect by the designer): U4 AE6(GPIO4_D0/PCIE_CLKREQNB)* L30(EMMC_TP)* P26(GPIO1_A6/TSADC_INT)* U28(GPIO0_B0/SDMMC0_WRPT/TEST_CLKOUT2)* V27(GPIO0_A5/EMMC_PWRON)* V28(GPIO0_A7/SDMMC0_DET)*

### Notes on the sheet
- THIS DOCUMENT AND THE DATA DISCLOSED HEREIN OR
- HEREWITH IS THE PROPERTY OF ALTIUM LIMITED AND MAY
- DWG NO:
- REVISION
- REV:
- DESCRIPTION
- DATE
- APPROVED
- BE FREELY DISTRIBUTED IN WHOLE. NO RIGHTS ARE
- RESERVED OR EXPRESS OR IMPLIED WARANTEE GIVEN.
- ENG:
- APPROVALS
- PROJECT
- DSN:
- CHK:
- REFERENCE DOCUMENTS
- PROJECT REVISION:
- TITLE
- DOCUMENT REVISION:
- DESIGN ITEM:
- BOM:
- FAB DWG:
- PCB DWG:
- ASSY DWG:
- SCALE:
- A3
- SIZE
- CAGE CODE
- FILE NAME
- DWG NO.
- SHEET
- OF
- REV
- (in symbol RK3399, part H) PCIe differential data I/O signals
- (in symbol RK3399, part L) SDMMC
- (in symbol RK3399, part N) eMMC
- (in symbol RK3399, part W) SAR-ADC

### Library data of the parts
C60-C67 = C1005X7R1H104M050BB: Description; Manufacturer_Name: TDK; Copyright: Copyright (C) 2025 Ultra Librarian. All rights reserved.; Manufacturer_Part_Number: C1005X7R1H104M050BB
R27 = CR0603AFX-1002EAS: Resistor, AS 0603 10k 1% 100mW TC100 | Bourns CR0603AFX-1002EAS; SnapEDA_Link: https://www.snapeda.com/parts/CR0603AFX-1002EAS/Bourns/view-part/?ref=snap; Package: 0603-2 Bourns; Value: *; MF: Bourns; MP: CR0603AFX-1002EAS; Check_prices: https://www.snapeda.com/parts/CR0603AFX-1002EAS/Bourns/view-part/?ref=eda
R28 = ERJXGNJ220Y: MP: ERJXGNJ220Y; Package: None; Price: None; Availability: Unavailable; Value: *
R29 = ERA6AHD330V: Package: None; MP: ERA6AHD330V; Price: None; Value: *; Availability: Unavailable
U4 = RK3399: as U4 on sheet TYPEC; SnapEDA_Link: https://www.snapeda.com/parts/RK3399/Fuzhou+Rockchip+Electronics+Co/view-part/?ref=snap; Package: Seeed Technology; MP: RK3399; Check_prices: https://www.snapeda.com/parts/RK3399/Fuzhou+Rockchip+Electronics+Co/view-part/?ref=eda; Price: None; Value: *; Availability: Not in stock

## Sheet RK3399 Side of LPDDR4 Controller.SchDoc
size 420 x 297 mm; SheetNumber: 7; SheetTotal: 26
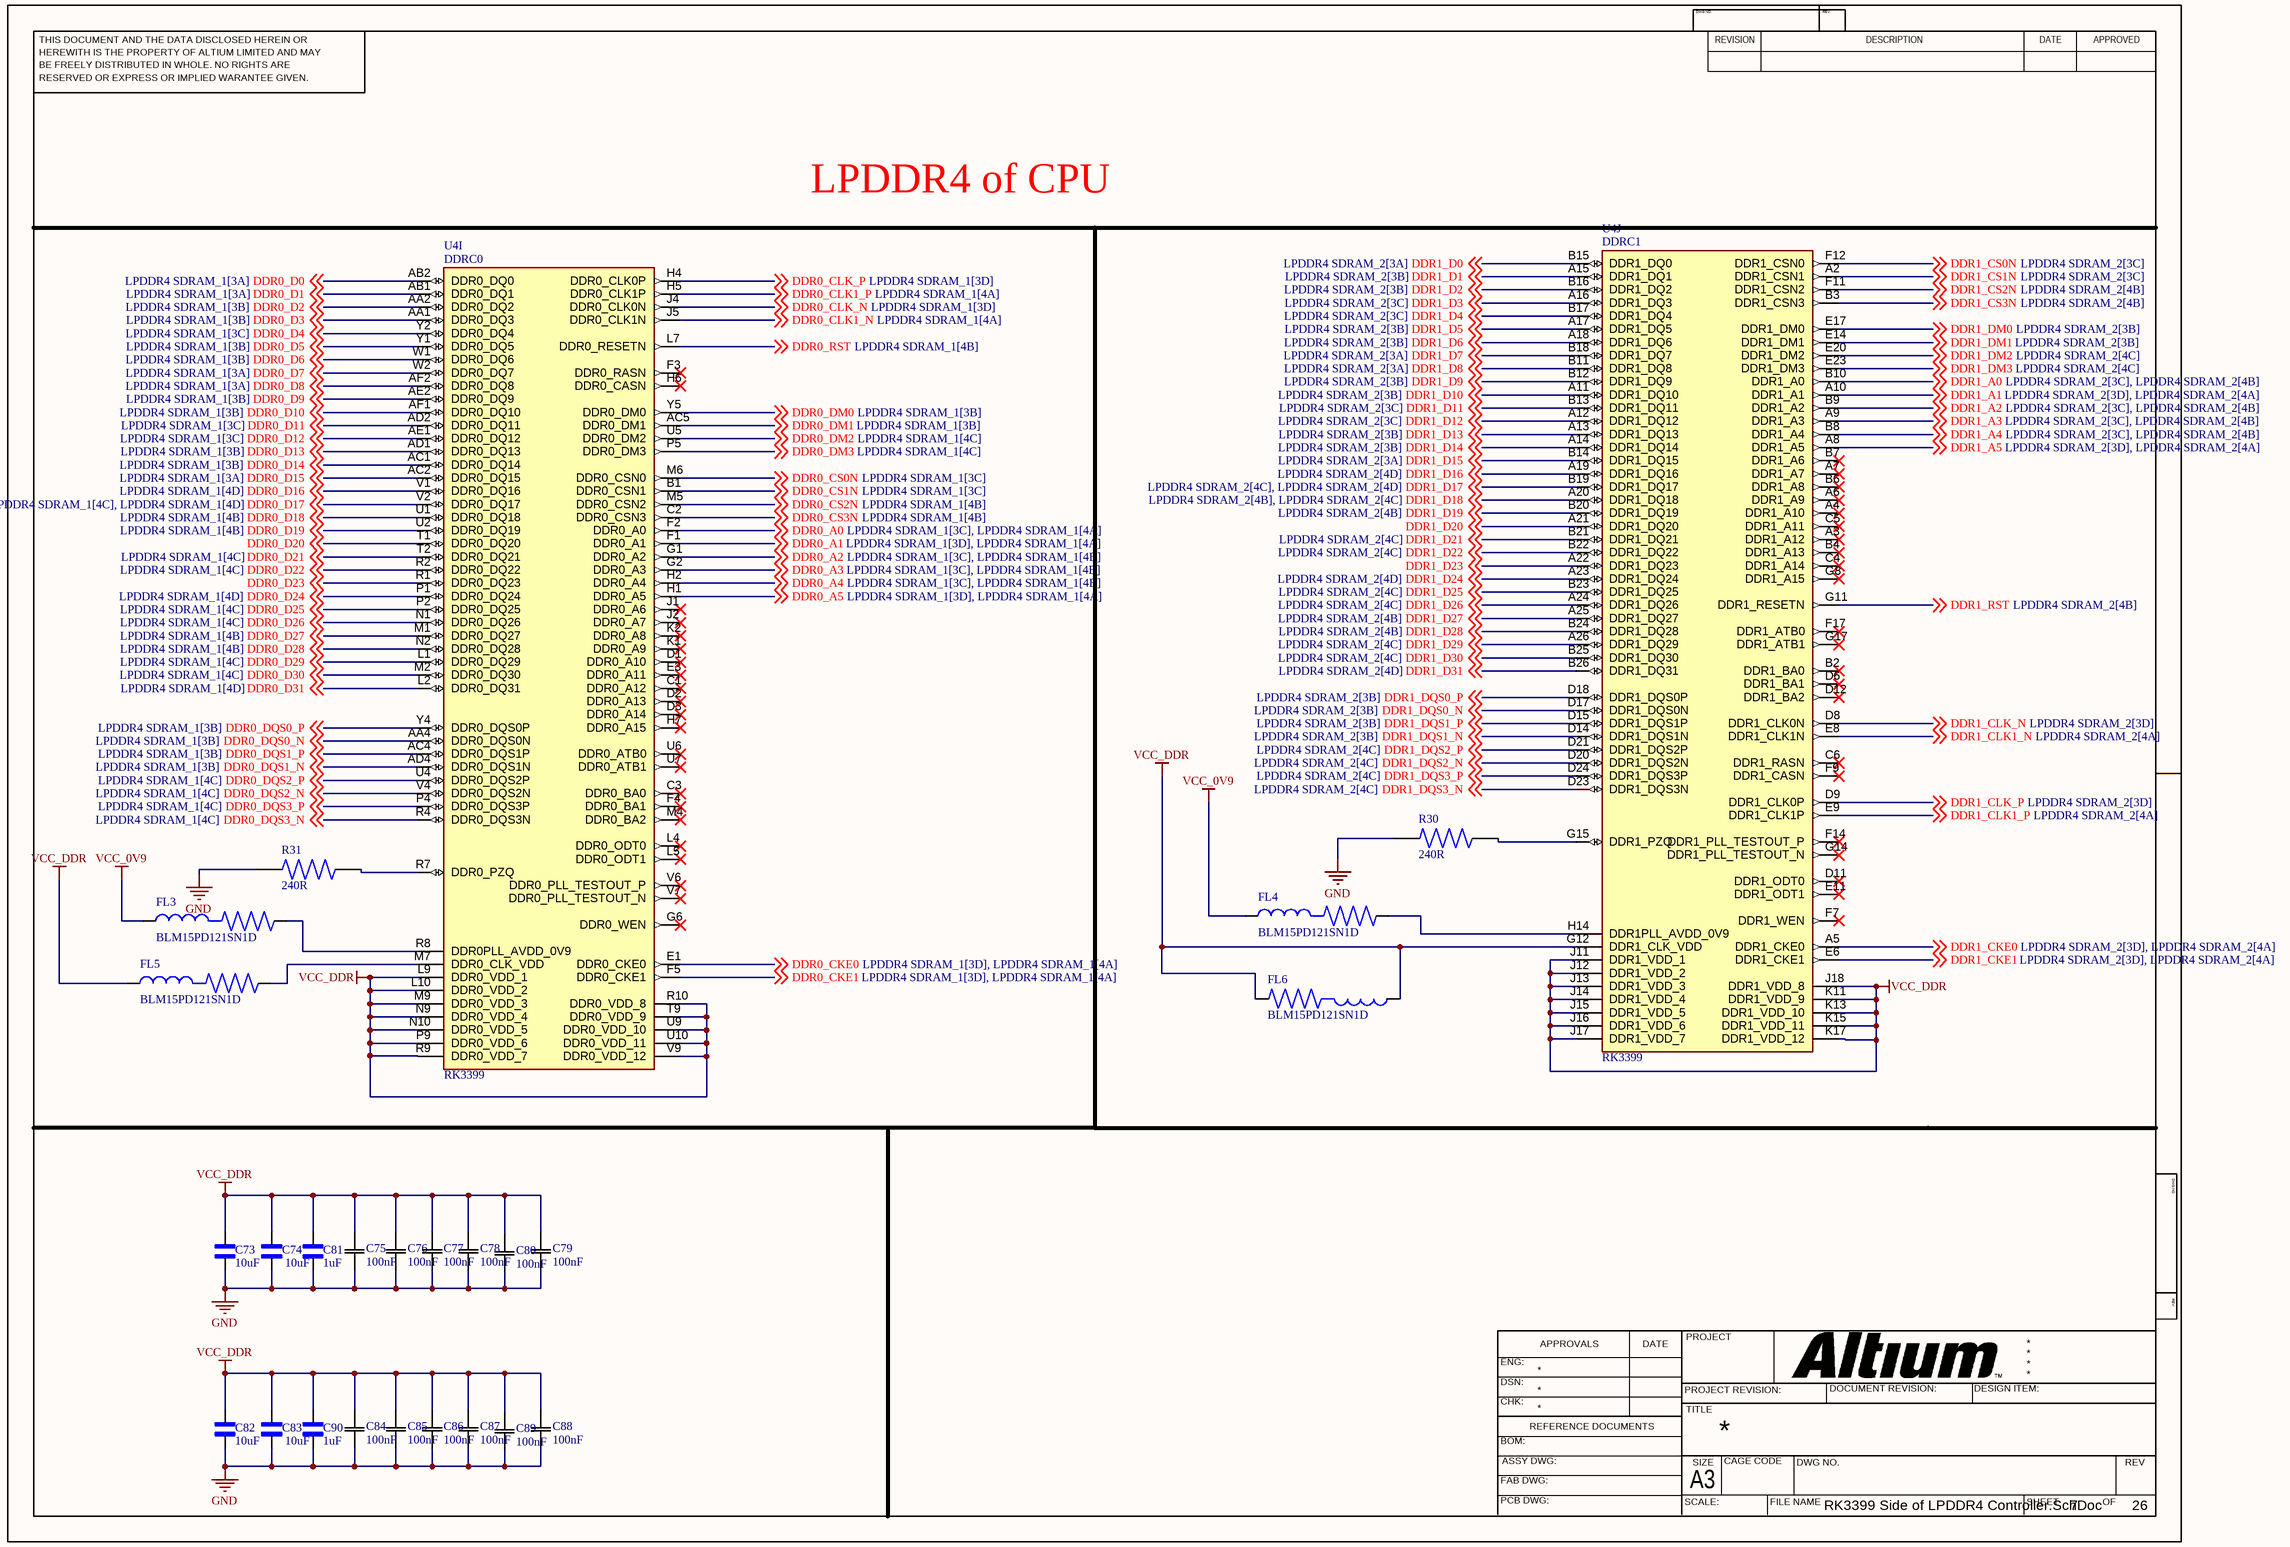
[diagram p6: RK3399 Side of LPDDR4 Controller.SchDoc]

### Parts
C73  10uF  [CAPC1005X71N]
C74  10uF  [CAPC1005X70N]
C75  100nF  [CAP_1005_TDK]
C76  100nF  [CAP_1005_TDK]
C77  100nF  [CAP_1005_TDK]
C78  100nF  [CAP_1005_TDK]
C79  100nF  [CAP_1005_TDK]
C80  100nF  [CAP_1005_TDK]
C81  1uF  [CAPC1005X56N]
C82  10uF  [CAPC1005X71N]
C83  10uF  [CAPC1005X70N]
C84  100nF  [CAP_1005_TDK]
C85  100nF  [CAP_1005_TDK]
C86  100nF  [CAP_1005_TDK]
C87  100nF  [CAP_1005_TDK]
C88  100nF  [CAP_1005_TDK]
C89  100nF  [CAP_1005_TDK]
C90  1uF  [CAPC1005X56N]
FL3  BLM15PD121SN1D  [BEADC1005X55N]
FL4  BLM15PD121SN1D  [BEADC1005X55N]
FL5  BLM15PD121SN1D  [BEADC1005X55N]
FL6  BLM15PD121SN1D  [BEADC1005X55N]
R30  240R  [RES_ERJP08F1101V]
R31  240R  [RESC1608X50N]
U4  RK3399  [BGA828C65P31X31_2100X2100X161N]  (parts I,J of 32)

### Nets
GND: C73.1 C74.1 C75.1 C76.1 C77.1 C78.1 C79.1 C80.1 C81.1 C82.1 C83.1 C84.1 C85.1 C86.1 C87.1 C88.1 C89.1 C90.1 R30.1 R31.1
VCC_0V9: FL3.1 FL4.1
VCC_DDR: C73.2 C74.2 C75.2 C76.2 C77.2 C78.2 C79.2 C80.2 C81.2 C82.2 C83.2 C84.2 C85.2 C86.2 C87.2 C88.2 C89.2 C90.2 FL5.1 FL6.1 FL6.2 U4.G12(DDR1_CLK_VDD) U4.J11(DDR1_VDD_1) U4.J12(DDR1_VDD_2) U4.J13(DDR1_VDD_3) U4.J14(DDR1_VDD_4) U4.J15(DDR1_VDD_5) U4.J16(DDR1_VDD_6) U4.J17(DDR1_VDD_7) U4.J18(DDR1_VDD_8) U4.K11(DDR1_VDD_9) U4.K13(DDR1_VDD_10) U4.K15(DDR1_VDD_11) U4.K17(DDR1_VDD_12) U4.L9(DDR0_VDD_1) U4.L10(DDR0_VDD_2) U4.M9(DDR0_VDD_3) U4.N9(DDR0_VDD_4) U4.N10(DDR0_VDD_5) U4.P9(DDR0_VDD_6) U4.R9(DDR0_VDD_7) U4.R10(DDR0_VDD_8) U4.T9(DDR0_VDD_9) U4.U9(DDR0_VDD_10) U4.U10(DDR0_VDD_11) U4.V9(DDR0_VDD_12)
DDR0_A0: U4.F2(DDR0_A0) ; off-sheet DDR0_A0
DDR0_A1: U4.F1(DDR0_A1) ; off-sheet DDR0_A1
DDR0_A2: U4.G1(DDR0_A2) ; off-sheet DDR0_A2
DDR0_A3: U4.G2(DDR0_A3) ; off-sheet DDR0_A3
DDR0_A4: U4.H2(DDR0_A4) ; off-sheet DDR0_A4
DDR0_A5: U4.H1(DDR0_A5) ; off-sheet DDR0_A5
DDR0_CKE0: U4.E1(DDR0_CKE0) ; off-sheet DDR0_CKE0
DDR0_CKE1: U4.F5(DDR0_CKE1) ; off-sheet DDR0_CKE1
DDR0_CLK1_N: U4.J5(DDR0_CLK1N) ; off-sheet DDR0_CLK1_N
DDR0_CLK1_P: U4.H5(DDR0_CLK1P) ; off-sheet DDR0_CLK1_P
DDR0_CLK_N: U4.J4(DDR0_CLK0N) ; off-sheet DDR0_CLK_N
DDR0_CLK_P: U4.H4(DDR0_CLK0P) ; off-sheet DDR0_CLK_P
DDR0_CS0N: U4.M6(DDR0_CSN0) ; off-sheet DDR0_CS0N
DDR0_CS1N: U4.B1(DDR0_CSN1) ; off-sheet DDR0_CS1N
DDR0_CS2N: U4.M5(DDR0_CSN2) ; off-sheet DDR0_CS2N
DDR0_CS3N: U4.C2(DDR0_CSN3) ; off-sheet DDR0_CS3N
DDR0_D0: U4.AB2(DDR0_DQ0) ; off-sheet DDR0_D0
DDR0_D1: U4.AB1(DDR0_DQ1) ; off-sheet DDR0_D1
DDR0_D2: U4.AA2(DDR0_DQ2) ; off-sheet DDR0_D2
DDR0_D3: U4.AA1(DDR0_DQ3) ; off-sheet DDR0_D3
DDR0_D4: U4.Y2(DDR0_DQ4) ; off-sheet DDR0_D4
DDR0_D5: U4.Y1(DDR0_DQ5) ; off-sheet DDR0_D5
DDR0_D6: U4.W1(DDR0_DQ6) ; off-sheet DDR0_D6
DDR0_D7: U4.W2(DDR0_DQ7) ; off-sheet DDR0_D7
DDR0_D8: U4.AF2(DDR0_DQ8) ; off-sheet DDR0_D8
DDR0_D9: U4.AE2(DDR0_DQ9) ; off-sheet DDR0_D9
DDR0_D10: U4.AF1(DDR0_DQ10) ; off-sheet DDR0_D10
DDR0_D11: U4.AD2(DDR0_DQ11) ; off-sheet DDR0_D11
DDR0_D12: U4.AE1(DDR0_DQ12) ; off-sheet DDR0_D12
DDR0_D13: U4.AD1(DDR0_DQ13) ; off-sheet DDR0_D13
DDR0_D14: U4.AC1(DDR0_DQ14) ; off-sheet DDR0_D14
DDR0_D15: U4.AC2(DDR0_DQ15) ; off-sheet DDR0_D15
DDR0_D16: U4.V1(DDR0_DQ16) ; off-sheet DDR0_D16
DDR0_D17: U4.V2(DDR0_DQ17) ; off-sheet DDR0_D17
DDR0_D18: U4.U1(DDR0_DQ18) ; off-sheet DDR0_D18
DDR0_D19: U4.U2(DDR0_DQ19) ; off-sheet DDR0_D19
DDR0_D20: U4.T1(DDR0_DQ20) ; off-sheet DDR0_D20
DDR0_D21: U4.T2(DDR0_DQ21) ; off-sheet DDR0_D21
DDR0_D22: U4.R2(DDR0_DQ22) ; off-sheet DDR0_D22
DDR0_D23: U4.R1(DDR0_DQ23) ; off-sheet DDR0_D23
DDR0_D24: U4.P1(DDR0_DQ24) ; off-sheet DDR0_D24
DDR0_D25: U4.P2(DDR0_DQ25) ; off-sheet DDR0_D25
DDR0_D26: U4.N1(DDR0_DQ26) ; off-sheet DDR0_D26
DDR0_D27: U4.M1(DDR0_DQ27) ; off-sheet DDR0_D27
DDR0_D28: U4.N2(DDR0_DQ28) ; off-sheet DDR0_D28
DDR0_D29: U4.L1(DDR0_DQ29) ; off-sheet DDR0_D29
DDR0_D30: U4.M2(DDR0_DQ30) ; off-sheet DDR0_D30
DDR0_D31: U4.L2(DDR0_DQ31) ; off-sheet DDR0_D31
DDR0_DM0: U4.Y5(DDR0_DM0) ; off-sheet DDR0_DM0
DDR0_DM1: U4.AC5(DDR0_DM1) ; off-sheet DDR0_DM1
DDR0_DM2: U4.U5(DDR0_DM2) ; off-sheet DDR0_DM2
DDR0_DM3: U4.P5(DDR0_DM3) ; off-sheet DDR0_DM3
DDR0_DQS0_N: U4.AA4(DDR0_DQS0N) ; off-sheet DDR0_DQS0_N
DDR0_DQS0_P: U4.Y4(DDR0_DQS0P) ; off-sheet DDR0_DQS0_P
DDR0_DQS1_N: U4.AD4(DDR0_DQS1N) ; off-sheet DDR0_DQS1_N
DDR0_DQS1_P: U4.AC4(DDR0_DQS1P) ; off-sheet DDR0_DQS1_P
DDR0_DQS2_N: U4.V4(DDR0_DQS2N) ; off-sheet DDR0_DQS2_N
DDR0_DQS2_P: U4.U4(DDR0_DQS2P) ; off-sheet DDR0_DQS2_P
DDR0_DQS3_N: U4.R4(DDR0_DQS3N) ; off-sheet DDR0_DQS3_N
DDR0_DQS3_P: U4.P4(DDR0_DQS3P) ; off-sheet DDR0_DQS3_P
DDR0_RST: U4.L7(DDR0_RESETN) ; off-sheet DDR0_RST
DDR1_A0: U4.B10(DDR1_A0) ; off-sheet DDR1_A0
DDR1_A1: U4.A10(DDR1_A1) ; off-sheet DDR1_A1
DDR1_A2: U4.B9(DDR1_A2) ; off-sheet DDR1_A2
DDR1_A3: U4.A9(DDR1_A3) ; off-sheet DDR1_A3
DDR1_A4: U4.B8(DDR1_A4) ; off-sheet DDR1_A4
DDR1_A5: U4.A8(DDR1_A5) ; off-sheet DDR1_A5
DDR1_CKE0: U4.A5(DDR1_CKE0) ; off-sheet DDR1_CKE0
DDR1_CKE1: U4.E6(DDR1_CKE1) ; off-sheet DDR1_CKE1
DDR1_CLK1_N: U4.E8(DDR1_CLK1N) ; off-sheet DDR1_CLK1_N
DDR1_CLK1_P: U4.E9(DDR1_CLK1P) ; off-sheet DDR1_CLK1_P
DDR1_CLK_N: U4.D8(DDR1_CLK0N) ; off-sheet DDR1_CLK_N
DDR1_CLK_P: U4.D9(DDR1_CLK0P) ; off-sheet DDR1_CLK_P
DDR1_CS0N: U4.F12(DDR1_CSN0) ; off-sheet DDR1_CS0N
DDR1_CS1N: U4.A2(DDR1_CSN1) ; off-sheet DDR1_CS1N
DDR1_CS2N: U4.F11(DDR1_CSN2) ; off-sheet DDR1_CS2N
DDR1_CS3N: U4.B3(DDR1_CSN3) ; off-sheet DDR1_CS3N
DDR1_D0: U4.B15(DDR1_DQ0) ; off-sheet DDR1_D0
DDR1_D1: U4.A15(DDR1_DQ1) ; off-sheet DDR1_D1
DDR1_D2: U4.B16(DDR1_DQ2) ; off-sheet DDR1_D2
DDR1_D3: U4.A16(DDR1_DQ3) ; off-sheet DDR1_D3
DDR1_D4: U4.B17(DDR1_DQ4) ; off-sheet DDR1_D4
DDR1_D5: U4.A17(DDR1_DQ5) ; off-sheet DDR1_D5
DDR1_D6: U4.A18(DDR1_DQ6) ; off-sheet DDR1_D6
DDR1_D7: U4.B18(DDR1_DQ7) ; off-sheet DDR1_D7
DDR1_D8: U4.B11(DDR1_DQ8) ; off-sheet DDR1_D8
DDR1_D9: U4.B12(DDR1_DQ9) ; off-sheet DDR1_D9
DDR1_D10: U4.A11(DDR1_DQ10) ; off-sheet DDR1_D10
DDR1_D11: U4.B13(DDR1_DQ11) ; off-sheet DDR1_D11
DDR1_D12: U4.A12(DDR1_DQ12) ; off-sheet DDR1_D12
DDR1_D13: U4.A13(DDR1_DQ13) ; off-sheet DDR1_D13
DDR1_D14: U4.A14(DDR1_DQ14) ; off-sheet DDR1_D14
DDR1_D15: U4.B14(DDR1_DQ15) ; off-sheet DDR1_D15
DDR1_D16: U4.A19(DDR1_DQ16) ; off-sheet DDR1_D16
DDR1_D17: U4.B19(DDR1_DQ17) ; off-sheet DDR1_D17
DDR1_D18: U4.A20(DDR1_DQ18) ; off-sheet DDR1_D18
DDR1_D19: U4.B20(DDR1_DQ19) ; off-sheet DDR1_D19
DDR1_D20: U4.A21(DDR1_DQ20) ; off-sheet DDR1_D20
DDR1_D21: U4.B21(DDR1_DQ21) ; off-sheet DDR1_D21
DDR1_D22: U4.B22(DDR1_DQ22) ; off-sheet DDR1_D22
DDR1_D23: U4.A22(DDR1_DQ23) ; off-sheet DDR1_D23
DDR1_D24: U4.A23(DDR1_DQ24) ; off-sheet DDR1_D24
DDR1_D25: U4.B23(DDR1_DQ25) ; off-sheet DDR1_D25
DDR1_D26: U4.A24(DDR1_DQ26) ; off-sheet DDR1_D26
DDR1_D27: U4.A25(DDR1_DQ27) ; off-sheet DDR1_D27
DDR1_D28: U4.B24(DDR1_DQ28) ; off-sheet DDR1_D28
DDR1_D29: U4.A26(DDR1_DQ29) ; off-sheet DDR1_D29
DDR1_D30: U4.B25(DDR1_DQ30) ; off-sheet DDR1_D30
DDR1_D31: U4.B26(DDR1_DQ31) ; off-sheet DDR1_D31
DDR1_DM0: U4.E17(DDR1_DM0) ; off-sheet DDR1_DM0
DDR1_DM1: U4.E14(DDR1_DM1) ; off-sheet DDR1_DM1
DDR1_DM2: U4.E20(DDR1_DM2) ; off-sheet DDR1_DM2
DDR1_DM3: U4.E23(DDR1_DM3) ; off-sheet DDR1_DM3
DDR1_DQS0_N: U4.D17(DDR1_DQS0N) ; off-sheet DDR1_DQS0_N
DDR1_DQS0_P: U4.D18(DDR1_DQS0P) ; off-sheet DDR1_DQS0_P
DDR1_DQS1_N: U4.D14(DDR1_DQS1N) ; off-sheet DDR1_DQS1_N
DDR1_DQS1_P: U4.D15(DDR1_DQS1P) ; off-sheet DDR1_DQS1_P
DDR1_DQS2_N: U4.D20(DDR1_DQS2N) ; off-sheet DDR1_DQS2_N
DDR1_DQS2_P: U4.D21(DDR1_DQS2P) ; off-sheet DDR1_DQS2_P
DDR1_DQS3_N: U4.D23(DDR1_DQS3N) ; off-sheet DDR1_DQS3_N
DDR1_DQS3_P: U4.D24(DDR1_DQS3P) ; off-sheet DDR1_DQS3_P
DDR1_RST: U4.G11(DDR1_RESETN) ; off-sheet DDR1_RST
NetFL3_2: FL3.2 U4.R8(DDR0PLL_AVDD_0V9)
NetFL4_2: FL4.2 U4.H14(DDR1PLL_AVDD_0V9)
NetFL5_2: FL5.2 U4.M7(DDR0_CLK_VDD)
NetR30_2: R30.2 U4.G15(DDR1_PZQ)
NetR31_2: R31.2 U4.R7(DDR0_PZQ)

Not connected (* = marked no-connect by the designer): U4 A3(DDR1_A12)* A4(DDR1_A10)* A6(DDR1_A9)* A7(DDR1_A7)* B2(DDR1_BA0)* B4(DDR1_A13)* B6(DDR1_A8)* B7(DDR1_A6)* C1(DDR0_A12)* C3(DDR0_BA0)* C4(DDR1_A14)* C5(DDR1_A11)* C6(DDR1_RASN)* D1(DDR0_A10)* D2(DDR0_A13)* D3(DDR0_A14)* D6(DDR1_BA1)* D11(DDR1_ODT0)* D12(DDR1_BA2)* E3(DDR0_A11)* E11(DDR1_ODT1)* F3(DDR0_RASN)* F4(DDR0_BA1)* F7(DDR1_WEN)* F9(DDR1_CASN)* F14(DDR1_PLL_TESTOUT_P)* F17(DDR1_ATB0)* G6(DDR0_WEN)* G8(DDR1_A15)* G14(DDR1_PLL_TESTOUT_N)* G17(DDR1_ATB1)* H6(DDR0_CASN)* H7(DDR0_A15)* J1(DDR0_A6)* J2(DDR0_A7)* K1(DDR0_A9)* K2(DDR0_A8)* L4(DDR0_ODT0)* L5(DDR0_ODT1)* M4(DDR0_BA2)* U6(DDR0_ATB0)* U7(DDR0_ATB1)* V6(DDR0_PLL_TESTOUT_P)* V7(DDR0_PLL_TESTOUT_N)*

### Notes on the sheet
- LPDDR4 of CPU
- THIS DOCUMENT AND THE DATA DISCLOSED HEREIN OR
- HEREWITH IS THE PROPERTY OF ALTIUM LIMITED AND MAY
- DWG NO:
- REVISION
- REV:
- DESCRIPTION
- DATE
- APPROVED
- BE FREELY DISTRIBUTED IN WHOLE. NO RIGHTS ARE
- RESERVED OR EXPRESS OR IMPLIED WARANTEE GIVEN.
- ENG:
- APPROVALS
- PROJECT
- DSN:
- CHK:
- REFERENCE DOCUMENTS
- PROJECT REVISION:
- TITLE
- DOCUMENT REVISION:
- DESIGN ITEM:
- BOM:
- FAB DWG:
- PCB DWG:
- ASSY DWG:
- SCALE:
- A3
- SIZE
- CAGE CODE
- FILE NAME
- DWG NO.
- SHEET
- OF
- REV
- (in symbol RK3399, part I) DDRC0
- (in symbol RK3399, part J) DDRC1

### Library data of the parts
C73 C82 = 04026D226MAT2A: 22 ÂµF Â±20% 6.3V Ceramic Capacitor X5R 0402 (1005 Metric); MF: AVX; SnapEDA_Link: https://www.snapeda.com/parts/04026D226MAT2A/AVX/view-part/?ref=snap; Package: 1005 AVX; Value: *; MP: 04026D226MAT2A; Check_prices: https://www.snapeda.com/parts/04026D226MAT2A/AVX/view-part/?ref=eda
C74 C83 = CL05A106MQ5NUNC: as C1 on sheet USB2.0; SnapEDA_Link: https://www.snapeda.com/parts/CL05A106MQ5NUNC/Samsung/view-part/?ref=snap; Package: SMD-2 Samsung; Value: *; MP: CL05A106MQ5NUNC; Check_prices: https://www.snapeda.com/parts/CL05A106MQ5NUNC/Samsung/view-part/?ref=eda
C75-C80 C84-C89 = C1005X7R1H104M050BB: Description; Manufacturer_Name: TDK; Copyright: Copyright (C) 2025 Ultra Librarian. All rights reserved.; Manufacturer_Part_Number: C1005X7R1H104M050BB
C81 C90 = 0402ZD105KAT4A: as C13 on sheet TYPEC0; SnapEDA_Link: https://www.snapeda.com/parts/0402ZD105KAT4A/AVX/view-part/?ref=snap; Package: 1005 AVX; Value: *; MP: 0402ZD105KAT4A; Check_prices: https://www.snapeda.com/parts/0402ZD105KAT4A/AVX/view-part/?ref=eda
FL3-FL6 = BLM15PD121SN1D: as FL1 on sheet System PMU for RK3399; SnapEDA_Link: https://www.snapeda.com/parts/BLM15PD121SN1D/Murata/view-part/?ref=snap; Package: 1005 Taiyo Yuden; Value: *; MP: BLM15PD121SN1D; Check_prices: https://www.snapeda.com/parts/BLM15PD121SN1D/Murata/view-part/?ref=eda
R30 R31 = ERA6AED241V: Value: *; Availability: Unavailable; Price: None; Package: None; MP: ERA6AED241V
U4 = RK3399: as U4 on sheet TYPEC; SnapEDA_Link: https://www.snapeda.com/parts/RK3399/Fuzhou+Rockchip+Electronics+Co/view-part/?ref=snap; Package: Seeed Technology; MP: RK3399; Check_prices: https://www.snapeda.com/parts/RK3399/Fuzhou+Rockchip+Electronics+Co/view-part/?ref=eda; Price: None; Value: *; Availability: Not in stock

## Sheet Power Supply Page for RK3399.SchDoc
size A3; SheetNumber: 8; SheetTotal: 26
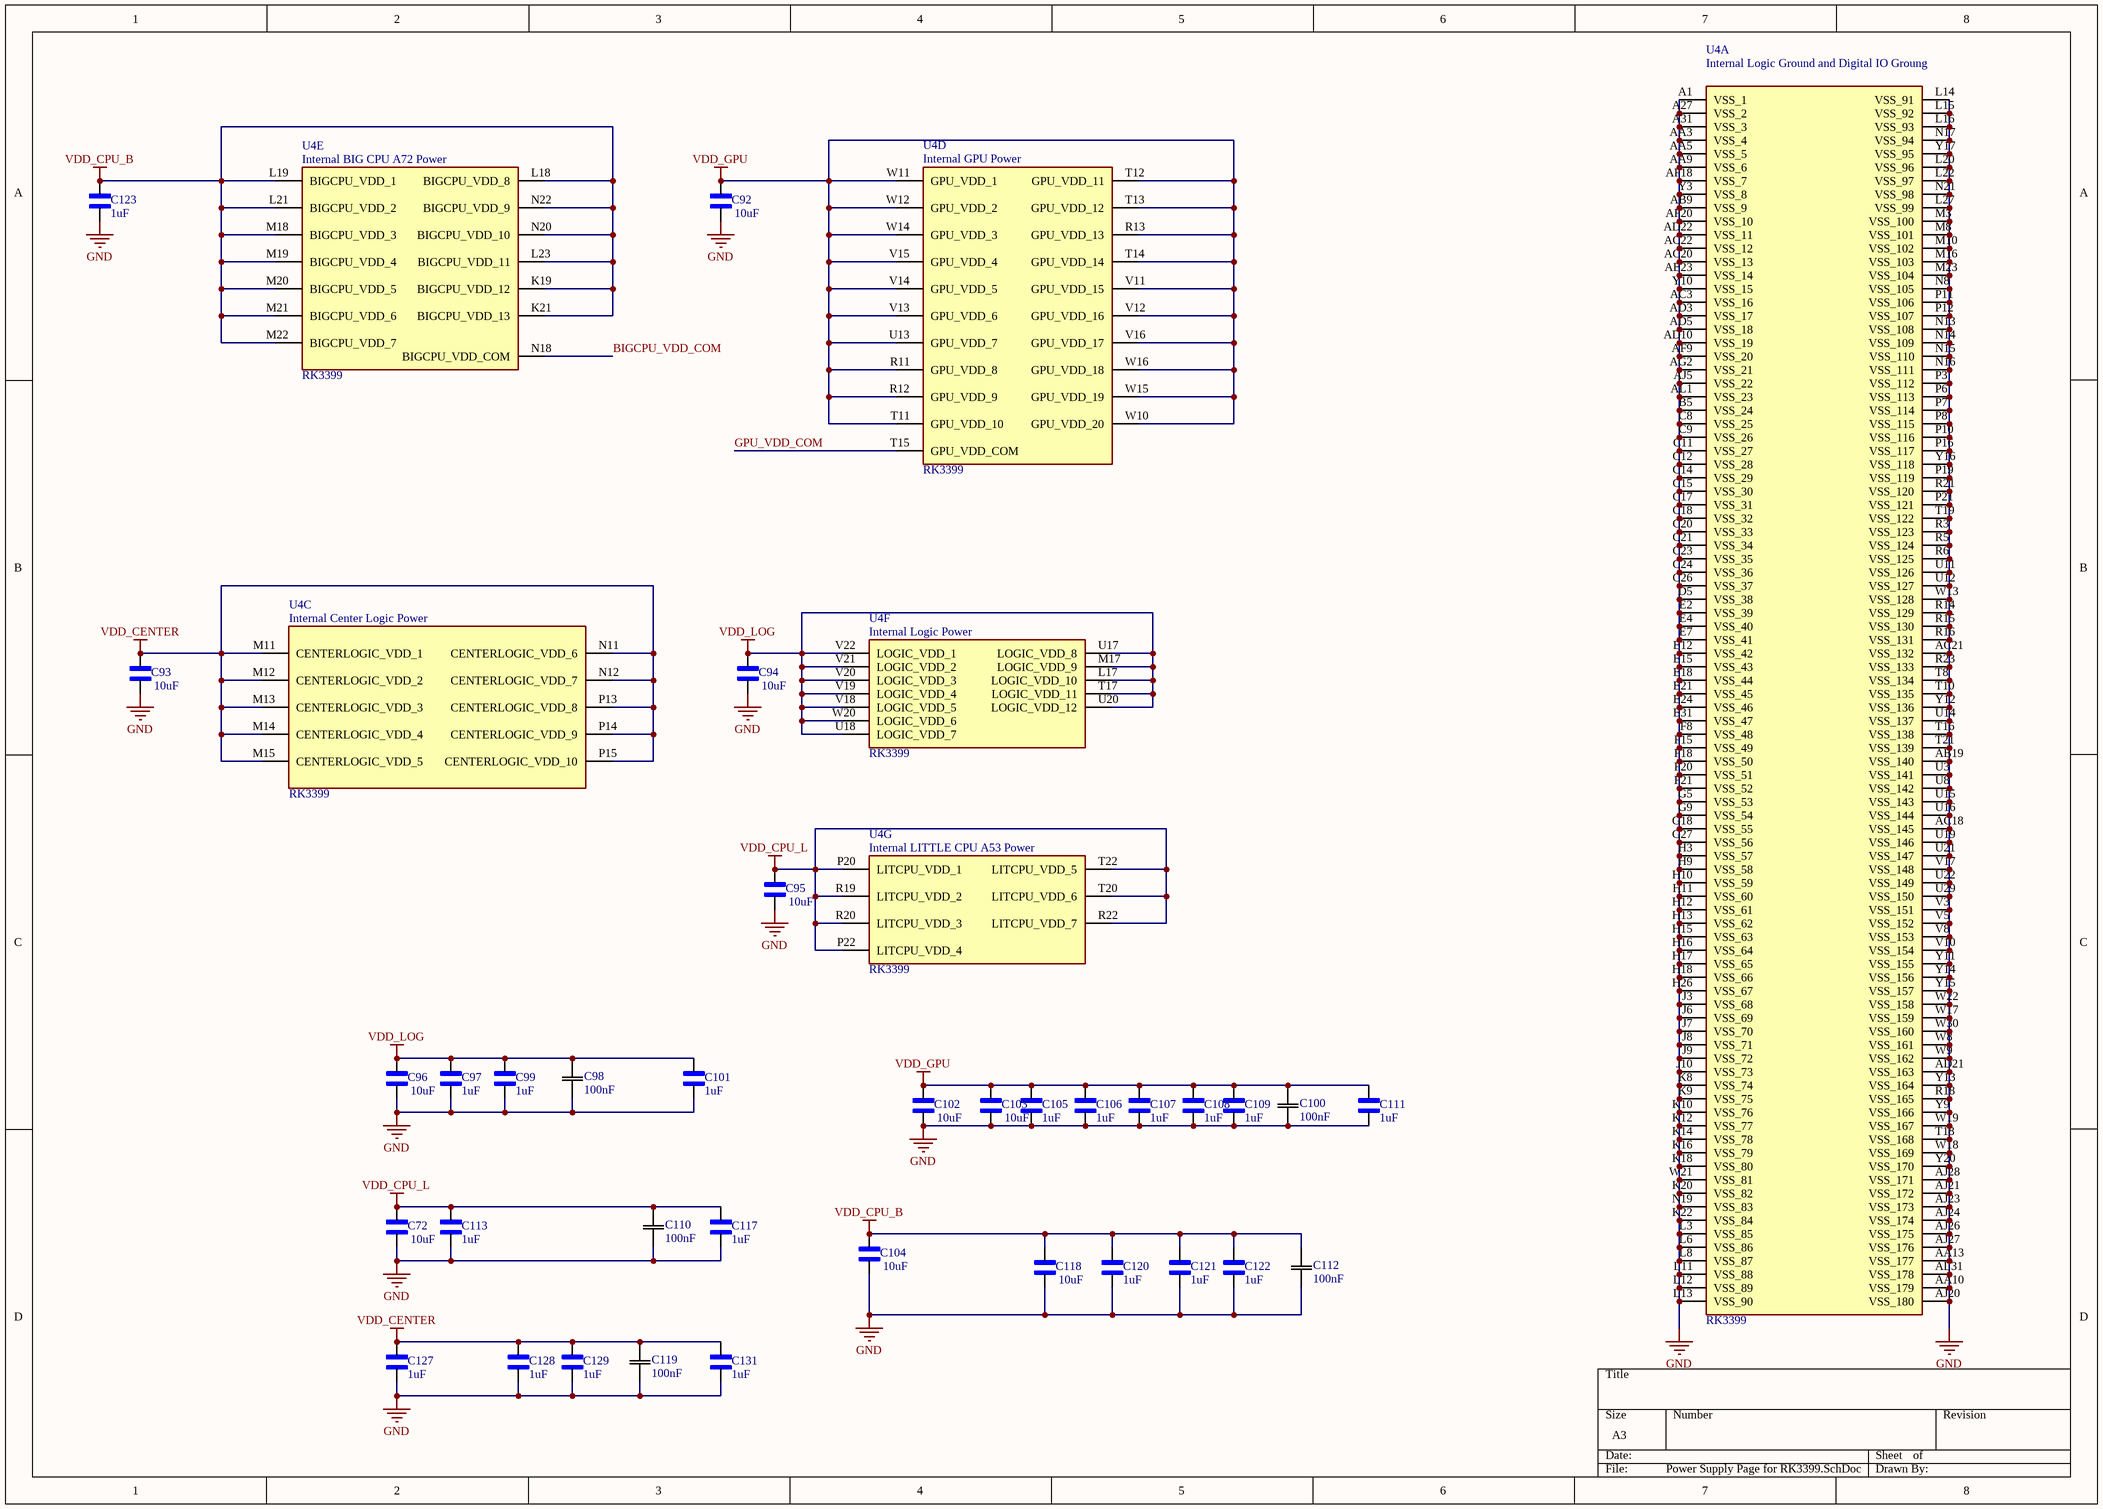
[diagram p7: Power Supply Page for RK3399.SchDoc]

### Parts
C72  10uF  [CAPC1005X70N]
C92  10uF  [CAPC1005X70N]
C93  10uF  [CAPC1005X70N]
C94  10uF  [CAPC1005X70N]
C95  10uF  [CAPC1005X70N]
C96  10uF  [CAPC1005X70N]
C97  1uF  [CAPC1005X56N]
C98  100nF  [CAP_1005_TDK]
C99  1uF  [CAPC1005X56N]
C100  100nF  [CAP_1005_TDK]
C101  1uF  [CAPC1005X56N]
C102  10uF  [CAPC1005X70N]
C103  10uF  [CAPC1005X70N]
C104  10uF  [CAPC1005X70N]
C105  1uF  [CAPC1005X56N]
C106  1uF  [CAPC1005X56N]
C107  1uF  [CAPC1005X56N]
C108  1uF  [CAPC1005X56N]
C109  1uF  [CAPC1005X56N]
C110  100nF  [CAP_1005_TDK]
C111  1uF  [CAPC1005X56N]
C112  100nF  [CAP_1005_TDK]
C113  1uF  [CAPC1005X56N]
C117  1uF  [CAPC1005X56N]
C118  10uF  [CAPC1005X70N]
C119  100nF  [CAP_1005_TDK]
C120  1uF  [CAPC1005X56N]
C121  1uF  [CAPC1005X56N]
C122  1uF  [CAPC1005X56N]
C123  1uF  [CAPC1005X56N]
C127  1uF  [CAPC1005X56N]
C128  1uF  [CAPC1005X56N]
C129  1uF  [CAPC1005X56N]
C131  1uF  [CAPC1005X56N]
U4  RK3399  [BGA828C65P31X31_2100X2100X161N]  (parts A,C,D,E,F,G of 32)

### Nets
GND: C72.1 C92.1 C93.1 C94.1 C95.1 C96.1 C97.1 C98.1 C99.1 C100.1 C101.1 C102.1 C103.1 C104.1 C105.1 C106.1 C107.1 C108.1 C109.1 C110.1 C111.1 C112.1 C113.1 C117.1 C118.1 C119.1 C120.1 C121.1 C122.1 C123.1 C127.1 C128.1 C129.1 C131.1 U4.A1(VSS_1) U4.A27(VSS_2) U4.A31(VSS_3) U4.AA3(VSS_4) U4.AA5(VSS_5) U4.AA9(VSS_6) U4.AA10(VSS_179) U4.AA13(VSS_177) U4.AB9(VSS_9) U4.AB19(VSS_140) U4.AC3(VSS_16) U4.AC18(VSS_145) U4.AC20(VSS_13) U4.AC21(VSS_132) U4.AC22(VSS_12) U4.AD3(VSS_17) U4.AD5(VSS_18) U4.AD10(VSS_19) U4.AD21(VSS_163) U4.AD22(VSS_11) U4.AE23(VSS_14) U4.AF9(VSS_20) U4.AF18(VSS_7) U4.AF20(VSS_10) U4.AG2(VSS_21) U4.AJ5(VSS_22) U4.AJ20(VSS_180) U4.AJ21(VSS_172) U4.AJ23(VSS_173) U4.AJ24(VSS_174) U4.AJ26(VSS_175) U4.AJ27(VSS_176) U4.AJ28(VSS_171) U4.AL1(VSS_23) U4.AL31(VSS_178) U4.B5(VSS_24) U4.C8(VSS_25) U4.C9(VSS_26) U4.C11(VSS_27) U4.C12(VSS_28) U4.C14(VSS_29) U4.C15(VSS_30) U4.C17(VSS_31) U4.C18(VSS_32) U4.C20(VSS_33) U4.C21(VSS_34) U4.C23(VSS_35) U4.C24(VSS_36) U4.C26(VSS_37) U4.D5(VSS_38) U4.E2(VSS_39) U4.E4(VSS_40) U4.E7(VSS_41) U4.E12(VSS_42) U4.E15(VSS_43) U4.E18(VSS_44) U4.E21(VSS_45) U4.E24(VSS_46) U4.E31(VSS_47) U4.F8(VSS_48) U4.F15(VSS_49) U4.F18(VSS_50) U4.F20(VSS_51) U4.F21(VSS_52) U4.G5(VSS_53) U4.G9(VSS_54) U4.G18(VSS_55) U4.G27(VSS_56) U4.H3(VSS_57) U4.H9(VSS_58) U4.H10(VSS_59) U4.H11(VSS_60) U4.H12(VSS_61) U4.H13(VSS_62) U4.H15(VSS_63) U4.H16(VSS_64) U4.H17(VSS_65) U4.H18(VSS_66) U4.H26(VSS_67) U4.J3(VSS_68) U4.J6(VSS_69) U4.J7(VSS_70) U4.J8(VSS_71) U4.J9(VSS_72) U4.J10(VSS_73) U4.K8(VSS_74) U4.K9(VSS_75) U4.K10(VSS_76) U4.K12(VSS_77) U4.K14(VSS_78) U4.K16(VSS_79) U4.K18(VSS_80) U4.K20(VSS_82) U4.K22(VSS_84) U4.L3(VSS_85) U4.L6(VSS_86) U4.L8(VSS_87) U4.L11(VSS_88) U4.L12(VSS_89) U4.L13(VSS_90) U4.L14(VSS_91) U4.L15(VSS_92) U4.L16(VSS_93) U4.L20(VSS_96) U4.L22(VSS_97) U4.L27(VSS_99) U4.M3(VSS_100) U4.M8(VSS_101) U4.M10(VSS_102) U4.M16(VSS_103) U4.M23(VSS_104) U4.N8(VSS_105) U4.N13(VSS_108) U4.N14(VSS_109) U4.N15(VSS_110) U4.N16(VSS_111) U4.N17(VSS_94) U4.N19(VSS_83) U4.N21(VSS_98) U4.P3(VSS_112) U4.P6(VSS_113) U4.P7(VSS_114) U4.P8(VSS_115) U4.P10(VSS_116) U4.P11(VSS_106) U4.P12(VSS_107) U4.P16(VSS_117) U4.P19(VSS_119) U4.P21(VSS_121) U4.R3(VSS_123) U4.R5(VSS_124) U4.R6(VSS_125) U4.R14(VSS_129) U4.R15(VSS_130) U4.R16(VSS_131) U4.R18(VSS_165) U4.R21(VSS_120) U4.R23(VSS_133) U4.T8(VSS_134) U4.T10(VSS_135) U4.T16(VSS_138) U4.T18(VSS_168) U4.T19(VSS_122) U4.T21(VSS_139) U4.U3(VSS_141) U4.U8(VSS_142) U4.U11(VSS_126) U4.U12(VSS_127) U4.U14(VSS_137) U4.U15(VSS_143) U4.U16(VSS_144) U4.U19(VSS_146) U4.U21(VSS_147) U4.U22(VSS_149) U4.U29(VSS_150) U4.V3(VSS_151) U4.V5(VSS_152) U4.V8(VSS_153) U4.V10(VSS_154) U4.V17(VSS_148) U4.W8(VSS_161) U4.W9(VSS_162) U4.W13(VSS_128) U4.W17(VSS_159) U4.W18(VSS_169) U4.W19(VSS_167) U4.W21(VSS_81) U4.W22(VSS_158) U4.W30(VSS_160) U4.Y3(VSS_8) U4.Y9(VSS_166) U4.Y10(VSS_15) U4.Y11(VSS_155) U4.Y12(VSS_136) U4.Y13(VSS_164) U4.Y14(VSS_156) U4.Y15(VSS_157) U4.Y16(VSS_118) U4.Y17(VSS_95) U4.Y20(VSS_170)
VDD_CENTER: C93.2 C119.2 C127.2 C128.2 C129.2 C131.2 U4.M11(CENTERLOGIC_VDD_1) U4.M12(CENTERLOGIC_VDD_2) U4.M13(CENTERLOGIC_VDD_3) U4.M14(CENTERLOGIC_VDD_4) U4.M15(CENTERLOGIC_VDD_5) U4.N11(CENTERLOGIC_VDD_6) U4.N12(CENTERLOGIC_VDD_7) U4.P13(CENTERLOGIC_VDD_8) U4.P14(CENTERLOGIC_VDD_9) U4.P15(CENTERLOGIC_VDD_10)
VDD_CPU_B: C104.2 C112.2 C118.2 C120.2 C121.2 C122.2 C123.2 U4.K19(BIGCPU_VDD_12) U4.K21(BIGCPU_VDD_13) U4.L18(BIGCPU_VDD_8) U4.L19(BIGCPU_VDD_1) U4.L21(BIGCPU_VDD_2) U4.L23(BIGCPU_VDD_11) U4.M18(BIGCPU_VDD_3) U4.M19(BIGCPU_VDD_4) U4.M20(BIGCPU_VDD_5) U4.M21(BIGCPU_VDD_6) U4.M22(BIGCPU_VDD_7) U4.N20(BIGCPU_VDD_10) U4.N22(BIGCPU_VDD_9)
VDD_CPU_L: C72.2 C95.2 C110.2 C113.2 C117.2 U4.P20(LITCPU_VDD_1) U4.P22(LITCPU_VDD_4) U4.R19(LITCPU_VDD_2) U4.R20(LITCPU_VDD_3) U4.R22(LITCPU_VDD_7) U4.T20(LITCPU_VDD_6) U4.T22(LITCPU_VDD_5)
VDD_GPU: C92.2 C100.2 C102.2 C103.2 C105.2 C106.2 C107.2 C108.2 C109.2 C111.2 U4.R11(GPU_VDD_8) U4.R12(GPU_VDD_9) U4.R13(GPU_VDD_13) U4.T11(GPU_VDD_10) U4.T12(GPU_VDD_11) U4.T13(GPU_VDD_12) U4.T14(GPU_VDD_14) U4.U13(GPU_VDD_7) U4.V11(GPU_VDD_15) U4.V12(GPU_VDD_16) U4.V13(GPU_VDD_6) U4.V14(GPU_VDD_5) U4.V15(GPU_VDD_4) U4.V16(GPU_VDD_17) U4.W10(GPU_VDD_20) U4.W11(GPU_VDD_1) U4.W12(GPU_VDD_2) U4.W14(GPU_VDD_3) U4.W15(GPU_VDD_19) U4.W16(GPU_VDD_18)
VDD_LOG: C94.2 C96.2 C97.2 C98.2 C99.2 C101.2 U4.L17(LOGIC_VDD_10) U4.M17(LOGIC_VDD_9) U4.T17(LOGIC_VDD_11) U4.U17(LOGIC_VDD_8) U4.U18(LOGIC_VDD_7) U4.U20(LOGIC_VDD_12) U4.V18(LOGIC_VDD_5) U4.V19(LOGIC_VDD_4) U4.V20(LOGIC_VDD_3) U4.V21(LOGIC_VDD_2) U4.V22(LOGIC_VDD_1) U4.W20(LOGIC_VDD_6)
BIGCPU_VDD_COM: U4.N18(BIGCPU_VDD_COM)
GPU_VDD_COM: U4.T15(GPU_VDD_COM)

### Notes on the sheet
- (in symbol RK3399, part A) Internal Logic Ground and Digital IO Groung
- (in symbol RK3399, part C) Internal Center Logic Power
- (in symbol RK3399, part D) Internal GPU Power
- (in symbol RK3399, part E) Internal BIG CPU A72 Power
- (in symbol RK3399, part F) Internal Logic Power
- (in symbol RK3399, part G) Internal LITTLE CPU A53 Power

### Library data of the parts
C72 C92-C96 C102-C104 C118 = CL05A106MQ5NUNC: as C1 on sheet USB2.0; SnapEDA_Link: https://www.snapeda.com/parts/CL05A106MQ5NUNC/Samsung/view-part/?ref=snap; Package: SMD-2 Samsung; Value: *; MP: CL05A106MQ5NUNC; Check_prices: https://www.snapeda.com/parts/CL05A106MQ5NUNC/Samsung/view-part/?ref=eda
C97 C99 C101 C105-C109 C111 C113 C117 C120-C123 C127-C129 C131 = 0402ZD105KAT4A: as C13 on sheet TYPEC0; SnapEDA_Link: https://www.snapeda.com/parts/0402ZD105KAT4A/AVX/view-part/?ref=snap; Package: 1005 AVX; Value: *; MP: 0402ZD105KAT4A; Check_prices: https://www.snapeda.com/parts/0402ZD105KAT4A/AVX/view-part/?ref=eda
C98 C100 C110 C112 C119 = C1005X7R1H104M050BB: Description; Manufacturer_Name: TDK; Copyright: Copyright (C) 2025 Ultra Librarian. All rights reserved.; Manufacturer_Part_Number: C1005X7R1H104M050BB
U4 = RK3399: as U4 on sheet TYPEC; SnapEDA_Link: https://www.snapeda.com/parts/RK3399/Fuzhou+Rockchip+Electronics+Co/view-part/?ref=snap; Package: Seeed Technology; MP: RK3399; Check_prices: https://www.snapeda.com/parts/RK3399/Fuzhou+Rockchip+Electronics+Co/view-part/?ref=eda; Price: None; Value: *; Availability: Not in stock